# EasyEDA Pro project project.epro, board PCB1
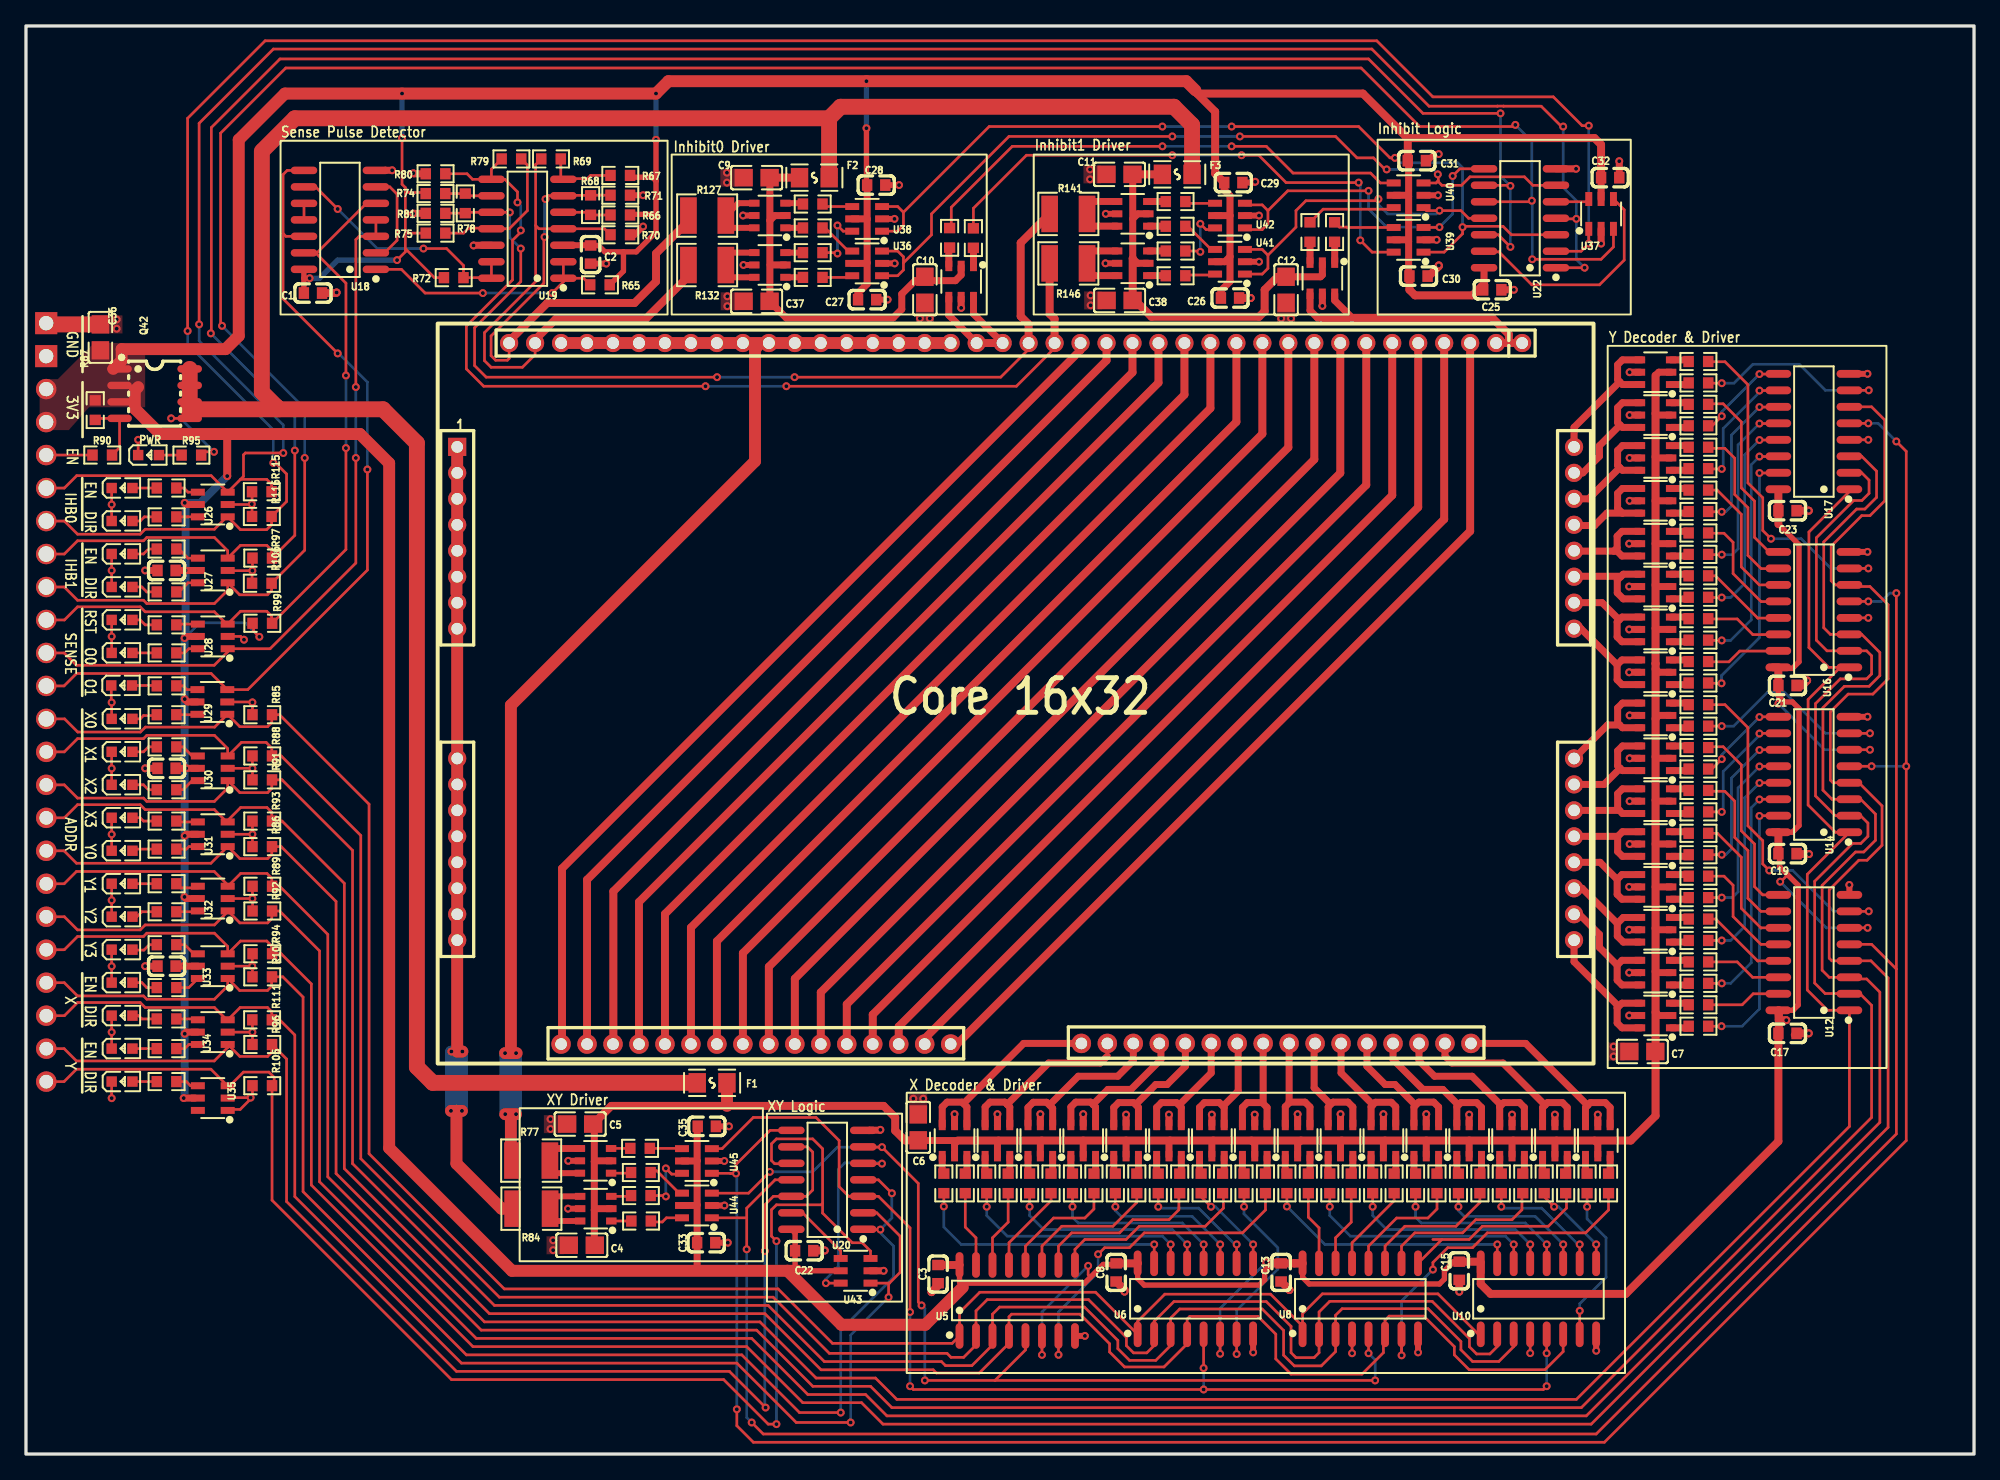
[diagram p4: board, top side]
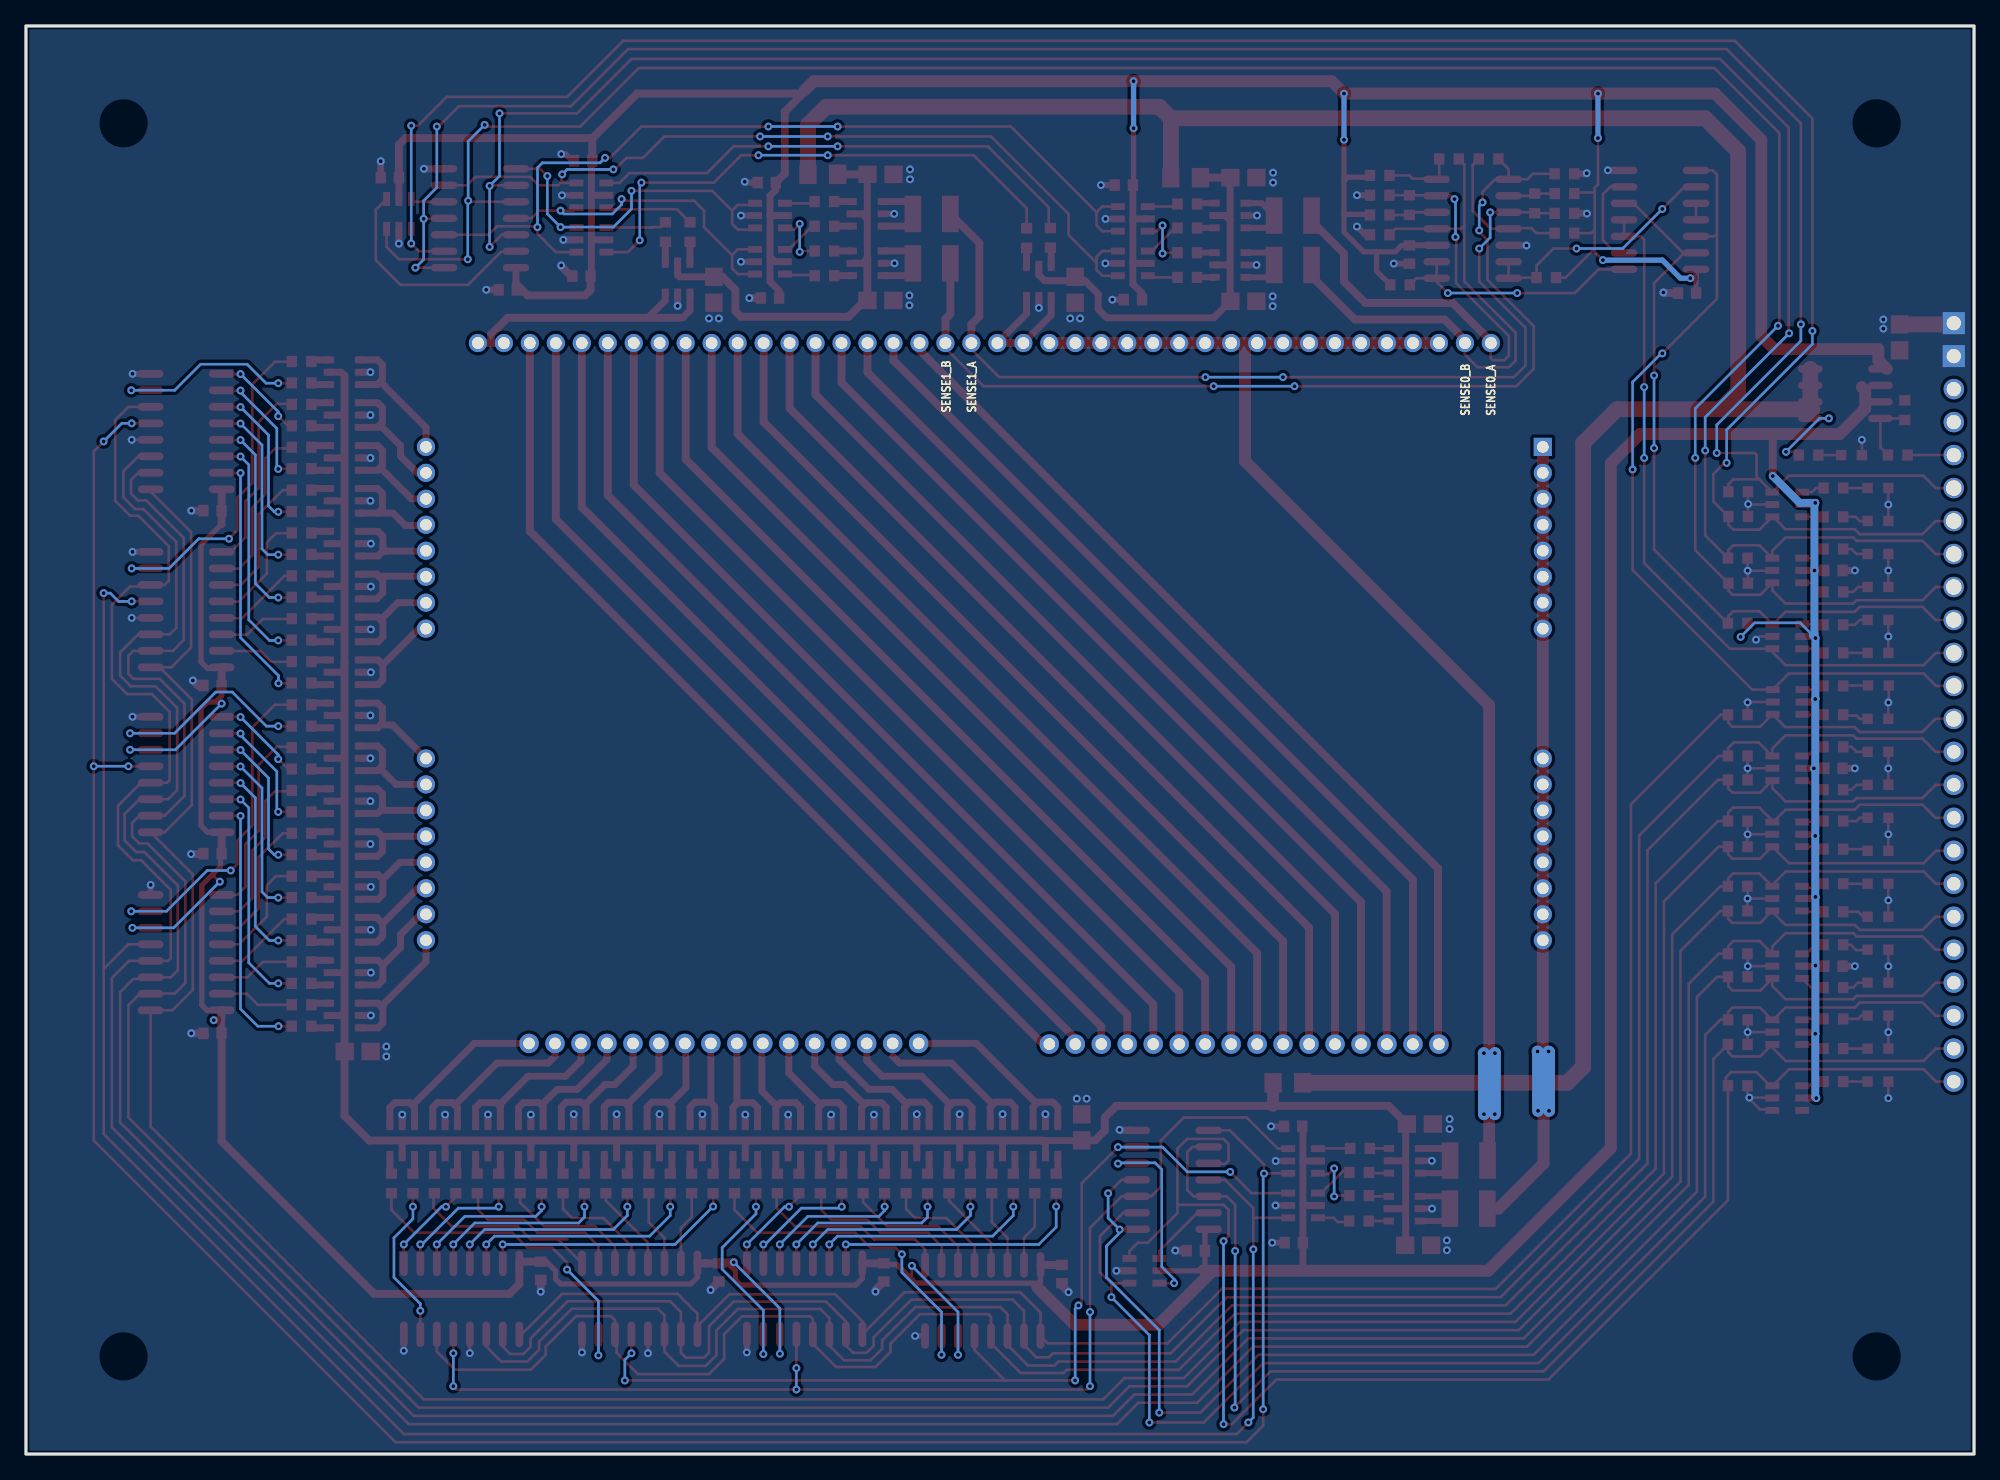
[diagram p5: board, bottom side, seen from below]

Outline 150 x 110 mm; copper layers: Top Layer, Bottom Layer. Coordinates in mm from the lower left corner of the outline.
Outline path: rectangle 0,110 150,0
Stack: Top Layer 0.035mm / Dielectric1 1.51mm FR4 er 4.5 / Bottom Layer 0.035mm

## Design rules (mm)
template: Custom Config
spacing copperThickness1oz (default): track to track 0.102, other pairs 0.152 to 0.3
spacing copperThickness2oz: track to track 0.203, other pairs 0.152 to 0.3
track width copperThickness1oz (default): min 0.127, default 0.203, max 2.54
track width copperThickness2oz: min 0.203, default 0.254, max 2.54
differential pair differentialPair (default): width min 0.127, default 0.254, max 2.54; gap min 0.152, default 0.152
via viaSize (default): diameter min 0.5, default 0.61, max 10; hole min 0.3, default 0.305, max 6.299
net GND uses copperRegion1

## Placement (name value [footprint] x y rotation side)
C1  100nF  [C0603]  22.1 89.43 180 top
C2  100nF  [C0603]  43.48 92.39 270 top
C3  100nF  [C0603]  70.23 13.86 90 top
C4  22uF  [C0805]  42.8 16.08 0 top
C5  22uF  [C0805]  42.67 25.42 0 top
C6  22uF  [C0805]  68.71 25.16 270 top
C7  22uF  [C0805]  124.46 31.01 0 top
C8  100nF  [C0603]  83.95 13.99 90 top
C9  22uF  [C0805]  56.26 98.32 0 top
C10  22uF  [C0805]  69.21 89.68 90 top
C11  22uF  [C0805]  84.2 98.57 0 top
C12  22uF  [C0805]  97.03 89.68 90 top
C13  100nF  [C0603]  96.65 13.99 90 top
C14  100nF  [C0603]  10.83 68.06 180 top
C15  100nF  [C0603]  110.36 14.12 90 top
C16  100nF  [C0603]  10.83 52.82 0 top
C17  100nF  [C0603]  135.64 32.4 180 top
C18  100nF  [C0603]  10.83 37.58 0 top
C19  100nF  [C0603]  135.64 46.25 180 top
C21  100nF  [C0603]  135.64 59.2 180 top
C22  100nF  [C0603]  59.92 15.66 0 top
C23  100nF  [C0603]  135.64 72.66 180 top
C25  100nF  [C0603]  112.91 89.68 0 top
C26  100nF  [C0603]  92.71 89.05 0 top
C27  100nF  [C0603]  64.77 88.92 0 top
C28  100nF  [C0603]  65.47 97.74 0 top
C29  100nF  [C0603]  92.96 97.94 0 top
C30  100nF  [C0603]  107.23 90.73 0 top
C31  100nF  [C0603]  107.1 99.62 0 top
C32  100nF  [C0603]  121.98 98.32 0 top
C33  100nF  [C0603]  52.38 16.28 0 top
C35  100nF  [C0603]  52.42 25.24 0 top
C36  22uF  [C0805]  5.73 86.01 270 top
C37  22uF  [C0805]  56.26 88.79 0 top
C38  22uF  [C0805]  84.21 88.86 0 top
F1  BSMD0805-075-16V  [F0805]  52.83 28.59 0 top
F2  BSMD0805-075-16V  [F0805]  60.71 98.32 180 top
F3  BSMD0805-075-16V  [F0805]  88.65 98.57 180 top
H1  2.0-1*40P母  [HDR-TH_40P-P2.00-V-F]  76.2 85.58 180 top
H2  PM200-1-16-Z-4.3  [HDR-TH_16P-P2.00-V-F]  56.2 31.58 0 top
H3  PM200-1-16-Z-4.3  [HDR-TH_16P-P2.00-V-F]  96.26 31.63 0 top
H4  -  [HDR-TH_5P-P2.54-V-M-NO-SILKSCREEN]  1.56 82.03 270 top
H5  MTP125-1108S1  [HDR-TH_8P-P2.54-H-M-NO-SILKSCREEN]  1.56 65.52 270 top
LED1  GREEN  [LED0603-RD]  9.44 76.94 0 top
LED2  RED  [LED0603-RD]  7.4 74.41 0 top
LED3  RED  [LED0603-RD]  7.4 71.87 0 top
LED4  RED  [LED0603-RD]  7.4 66.79 0 top
LED5  RED  [LED0603-RD]  7.4 69.33 0 top
LED6  RED  [LED0603-RD]  7.4 61.71 0 top
LED7  RED  [LED0603-RD]  7.4 64.25 0 top
LED8  RED  [LED0603-RD]  7.37 59.2 0 top
LED9  RED  [LED0603-RD]  7.4 56.63 0 top
LED10  RED  [LED0603-RD]  7.4 51.55 0 top
LED11  RED  [LED0603-RD]  7.4 54.09 0 top
LED12  RED  [LED0603-RD]  7.4 49.01 0 top
LED13  RED  [LED0603-RD]  7.4 46.47 0 top
LED14  RED  [LED0603-RD]  7.4 43.93 0 top
LED15  RED  [LED0603-RD]  7.4 41.39 0 top
LED16  RED  [LED0603-RD]  7.4 36.31 0 top
LED17  RED  [LED0603-RD]  7.4 38.85 0 top
LED18  RED  [LED0603-RD]  7.4 33.77 0 top
LED19  RED  [LED0603-RD]  7.4 31.23 0 top
LED20  RED  [LED0603-RD]  7.4 28.69 0 top
Q1  DMG6602SVT-7  [TSOT-23-6_L2.9-W1.6-P0.95-LS2.8-BR]  71.5 24.15 270 top
Q2  DMG6602SVT-7  [TSOT-23-6_L2.9-W1.6-P0.95-LS2.8-BR]  74.8 24.15 270 top
Q3  DMG6602SVT-7  [TSOT-23-6_L2.9-W1.6-P0.95-LS2.8-BR]  78.11 24.15 270 top
Q4  DMG6602SVT-7  [TSOT-23-6_L2.9-W1.6-P0.95-LS2.8-BR]  81.41 24.15 270 top
Q5  DMG6602SVT-7  [TSOT-23-6_L2.9-W1.6-P0.95-LS2.8-BR]  84.71 24.15 270 top
Q6  DMG6602SVT-7  [TSOT-23-6_L2.9-W1.6-P0.95-LS2.8-BR]  88.01 24.15 270 top
Q7  DMG6602SVT-7  [TSOT-23-6_L2.9-W1.6-P0.95-LS2.8-BR]  91.31 24.15 270 top
Q8  DMG6602SVT-7  [TSOT-23-6_L2.9-W1.6-P0.95-LS2.8-BR]  94.61 24.15 270 top
Q9  DMG6602SVT-7  [TSOT-23-6_L2.9-W1.6-P0.95-LS2.8-BR]  97.92 24.15 270 top
Q10  DMG6602SVT-7  [TSOT-23-6_L2.9-W1.6-P0.95-LS2.8-BR]  101.22 24.15 270 top
Q11  DMG6602SVT-7  [TSOT-23-6_L2.9-W1.6-P0.95-LS2.8-BR]  104.52 24.15 270 top
Q12  DMG6602SVT-7  [TSOT-23-6_L2.9-W1.6-P0.95-LS2.8-BR]  107.82 24.15 270 top
Q13  DMG6602SVT-7  [TSOT-23-6_L2.9-W1.6-P0.95-LS2.8-BR]  111.13 24.15 270 top
Q14  DMG6602SVT-7  [TSOT-23-6_L2.9-W1.6-P0.95-LS2.8-BR]  114.43 24.15 270 top
Q15  DMG6602SVT-7  [TSOT-23-6_L2.9-W1.6-P0.95-LS2.8-BR]  117.73 24.15 270 top
Q16  DMG6602SVT-7  [TSOT-23-6_L2.9-W1.6-P0.95-LS2.8-BR]  121.03 24.15 270 top
Q17  DMG6602SVT-7  [TSOT-23-6_L2.9-W1.6-P0.95-LS2.8-BR]  125.48 33.78 0 top
Q18  DMG6602SVT-7  [TSOT-23-6_L2.9-W1.6-P0.95-LS2.8-BR]  125.48 37.08 0 top
Q19  DMG6602SVT-7  [TSOT-23-6_L2.9-W1.6-P0.95-LS2.8-BR]  125.48 40.38 0 top
Q20  DMG6602SVT-7  [TSOT-23-6_L2.9-W1.6-P0.95-LS2.8-BR]  125.48 43.69 0 top
Q21  DMG6602SVT-7  [TSOT-23-6_L2.9-W1.6-P0.95-LS2.8-BR]  125.48 46.99 0 top
Q22  DMG6602SVT-7  [TSOT-23-6_L2.9-W1.6-P0.95-LS2.8-BR]  125.48 50.29 0 top
Q23  DMG6602SVT-7  [TSOT-23-6_L2.9-W1.6-P0.95-LS2.8-BR]  125.48 53.59 0 top
Q24  DMG6602SVT-7  [TSOT-23-6_L2.9-W1.6-P0.95-LS2.8-BR]  125.48 56.89 0 top
Q25  DMG6602SVT-7  [TSOT-23-6_L2.9-W1.6-P0.95-LS2.8-BR]  125.48 60.22 0 top
Q26  DMG6602SVT-7  [TSOT-23-6_L2.9-W1.6-P0.95-LS2.8-BR]  125.48 63.52 0 top
Q27  DMG6602SVT-7  [TSOT-23-6_L2.9-W1.6-P0.95-LS2.8-BR]  125.48 66.82 0 top
Q28  DMG6602SVT-7  [TSOT-23-6_L2.9-W1.6-P0.95-LS2.8-BR]  125.48 70.12 0 top
Q29  DMG6602SVT-7  [TSOT-23-6_L2.9-W1.6-P0.95-LS2.8-BR]  125.48 73.42 0 top
Q30  DMG6602SVT-7  [TSOT-23-6_L2.9-W1.6-P0.95-LS2.8-BR]  125.48 76.73 0 top
Q31  DMG6602SVT-7  [TSOT-23-6_L2.9-W1.6-P0.95-LS2.8-BR]  125.48 80.03 0 top
Q32  DMG6602SVT-7  [TSOT-23-6_L2.9-W1.6-P0.95-LS2.8-BR]  125.48 83.33 0 top
Q33  DMG6602SVT-7  [TSOT-23-6_L2.9-W1.6-P0.95-LS2.8-BR]  43.85 22.58 0 top
Q34  DMG6602SVT-7  [TSOT-23-6_L2.9-W1.6-P0.95-LS2.8-BR]  43.87 18.9 0 top
Q36  DMG6602SVT-7  [TSOT-23-6_L2.9-W1.6-P0.95-LS2.8-BR]  57.28 95.4 0 top
Q37  DMG6602SVT-7  [TSOT-23-6_L2.9-W1.6-P0.95-LS2.8-BR]  57.28 91.59 0 top
Q38  DMG6602SVT-7  [TSOT-23-6_L2.9-W1.6-P0.95-LS2.8-BR]  72.01 90.31 90 top
Q39  DMG6602SVT-7  [TSOT-23-6_L2.9-W1.6-P0.95-LS2.8-BR]  85.22 95.53 0 top
Q40  DMG6602SVT-7  [TSOT-23-6_L2.9-W1.6-P0.95-LS2.8-BR]  85.22 91.72 0 top
Q41  DMG6602SVT-7  [TSOT-23-6_L2.9-W1.6-P0.95-LS2.8-BR]  99.82 90.57 90 top
Q42  VBA2311  [SO-8_L4.9-W3.9-P1.27-LS5.9-BL]  9.91 81.68 270 top
R1  150Ω  [R0603]  70.68 20.85 90 top
R2  150Ω  [R0603]  72.33 20.85 90 top
R3  150Ω  [R0603]  73.98 20.85 90 top
R4  150Ω  [R0603]  75.63 20.85 90 top
R5  150Ω  [R0603]  77.28 20.85 90 top
R6  150Ω  [R0603]  78.93 20.85 90 top
R7  150Ω  [R0603]  80.58 20.85 90 top
R8  150Ω  [R0603]  82.23 20.85 90 top
R9  150Ω  [R0603]  83.88 20.85 90 top
R10  150Ω  [R0603]  85.53 20.85 90 top
R11  150Ω  [R0603]  87.19 20.85 90 top
R12  150Ω  [R0603]  88.84 20.85 90 top
R13  150Ω  [R0603]  90.49 20.85 90 top
R14  150Ω  [R0603]  92.14 20.85 90 top
R15  150Ω  [R0603]  93.79 20.85 90 top
R16  150Ω  [R0603]  95.44 20.85 90 top
R17  150Ω  [R0603]  97.09 20.85 90 top
R18  150Ω  [R0603]  98.74 20.85 90 top
R19  150Ω  [R0603]  100.39 20.85 90 top
R20  150Ω  [R0603]  102.04 20.85 90 top
R21  150Ω  [R0603]  103.7 20.85 90 top
R22  150Ω  [R0603]  105.35 20.85 90 top
R23  150Ω  [R0603]  107 20.85 90 top
R24  150Ω  [R0603]  108.65 20.85 90 top
R25  150Ω  [R0603]  110.3 20.85 90 top
R26  150Ω  [R0603]  111.95 20.85 90 top
R27  150Ω  [R0603]  113.6 20.85 90 top
R28  150Ω  [R0603]  115.25 20.85 90 top
R29  150Ω  [R0603]  116.9 20.85 90 top
R30  150Ω  [R0603]  118.55 20.85 90 top
R31  150Ω  [R0603]  120.21 20.85 90 top
R32  150Ω  [R0603]  121.86 20.85 90 top
R33  150Ω  [R0603]  128.78 32.95 180 top
R34  150Ω  [R0603]  128.78 34.6 180 top
R35  150Ω  [R0603]  128.78 36.26 180 top
R36  150Ω  [R0603]  128.78 37.91 180 top
R37  150Ω  [R0603]  128.78 39.56 180 top
R38  150Ω  [R0603]  128.78 41.21 180 top
R39  150Ω  [R0603]  128.78 42.86 180 top
R40  150Ω  [R0603]  128.78 44.51 180 top
R41  150Ω  [R0603]  128.78 46.16 180 top
R42  150Ω  [R0603]  128.78 47.81 180 top
R43  150Ω  [R0603]  128.78 49.46 180 top
R44  150Ω  [R0603]  128.78 51.11 180 top
R45  150Ω  [R0603]  128.78 52.77 180 top
R46  150Ω  [R0603]  128.78 54.42 180 top
R47  150Ω  [R0603]  128.78 56.07 180 top
R48  150Ω  [R0603]  128.78 57.72 180 top
R49  150Ω  [R0603]  128.78 59.39 180 top
R50  150Ω  [R0603]  128.78 61.04 180 top
R51  150Ω  [R0603]  128.78 62.69 180 top
R52  150Ω  [R0603]  128.78 64.34 180 top
R53  150Ω  [R0603]  128.78 65.99 180 top
R54  150Ω  [R0603]  128.78 67.65 180 top
R55  150Ω  [R0603]  128.78 69.3 180 top
R56  150Ω  [R0603]  128.78 70.95 180 top
R57  150Ω  [R0603]  128.78 72.6 180 top
R58  150Ω  [R0603]  128.78 74.25 180 top
R59  150Ω  [R0603]  128.78 75.9 180 top
R60  150Ω  [R0603]  128.78 77.55 180 top
R61  150Ω  [R0603]  128.78 79.2 180 top
R62  150Ω  [R0603]  128.78 80.85 180 top
R63  150Ω  [R0603]  128.78 82.5 180 top
R64  150Ω  [R0603]  128.78 84.16 180 top
R65  1kΩ  [R0603]  44.2 90.06 0 top
R66  1kΩ  [R0603]  45.76 95.44 0 top
R67  1kΩ  [R0603]  45.76 98.49 0 top
R68  24  [R0603]  43.48 96.2 90 top
R69  24  [R0603]  40.43 99.76 0 top
R70  1kΩ  [R0603]  45.76 93.92 180 top
R71  1kΩ  [R0603]  45.76 96.96 180 top
R72  1kΩ  [R0603]  32.94 90.61 180 top
R73  150Ω  [R0603]  47.34 21.69 180 top
R74  1kΩ  [R0603]  31.53 97.09 180 top
R75  1kΩ  [R0603]  31.54 94.04 180 top
R76  150Ω  [R0603]  47.28 23.54 180 top
R77  10Ω  [R1210]  38.9 22.6 0 top
R78  24  [R0603]  33.83 96.34 270 top
R79  24  [R0603]  37.38 99.76 0 top
R80  1kΩ  [R0603]  31.54 98.61 0 top
R81  1kΩ  [R0603]  31.54 95.57 0 top
R82  150Ω  [R0603]  47.36 17.95 180 top
R83  150Ω  [R0603]  47.34 19.91 180 top
R84  10Ω  [R1210]  38.92 18.9 0 top
R85  10kΩ  [R0603]  18.19 56.95 0 top
R86  10kΩ  [R0603]  18.19 46.79 180 top
R87  10kΩ  [R0603]  5.33 80.41 270 top
R88  10kΩ  [R0603]  18.19 53.77 0 top
R89  10kΩ  [R0603]  18.2 43.73 0 top
R90  1kΩ  [R0603]  5.87 76.95 180 top
R91  10kΩ  [R0603]  18.19 51.93 0 top
R92  10kΩ  [R0603]  18.2 41.83 180 top
R93  10kΩ  [R0603]  18.19 48.75 0 top
R94  10kΩ  [R0603]  18.2 38.54 180 top
R95  5.1kΩ  [R0603]  12.74 76.94 180 top
R96  10kΩ  [R0603]  18.19 31.55 0 top
R97  10kΩ  [R0603]  18.19 69.01 180 top
R98  2.7kΩ  [R0603]  10.83 74.41 0 top
R99  10kΩ  [R0603]  18.2 63.99 180 top
R100  2.7kΩ  [R0603]  10.83 66.41 180 top
R101  2.7kΩ  [R0603]  10.83 72.19 0 top
R102  2.7kΩ  [R0603]  10.83 69.71 0 top
R103  2.7kΩ  [R0603]  10.83 61.71 180 top
R104  2.7kΩ  [R0603]  10.83 63.87 180 top
R105  10kΩ  [R0603]  18.19 28.37 180 top
R106  10kΩ  [R0603]  18.16 67.07 180 top
R107  10kΩ  [R0603]  18.19 36.76 180 top
R108  2.7kΩ  [R0603]  10.83 59.17 0 top
R109  2.7kΩ  [R0603]  10.83 51.17 0 top
R110  2.7kΩ  [R0603]  10.83 56.95 0 top
R111  10kΩ  [R0603]  18.18 33.45 180 top
R112  2.7kΩ  [R0603]  10.83 54.47 0 top
R113  2.7kΩ  [R0603]  10.83 48.75 0 top
R114  2.7kΩ  [R0603]  10.83 46.6 0 top
R115  10kΩ  [R0603]  18.16 74.12 0 top
R116  10kΩ  [R0603]  18.16 72.22 180 top
R117  2.7kΩ  [R0603]  10.83 43.93 0 top
R118  2.7kΩ  [R0603]  10.83 35.93 180 top
R119  2.7kΩ  [R0603]  10.83 41.77 0 top
R120  2.7kΩ  [R0603]  10.83 39.23 0 top
R121  2.7kΩ  [R0603]  10.83 33.52 180 top
R122  2.7kΩ  [R0603]  10.83 31.23 180 top
R123  2.7kΩ  [R0603]  10.83 28.69 0 top
R125  150Ω  [R0603]  60.58 94.44 180 top
R126  150Ω  [R0603]  60.58 96.28 180 top
R127  10Ω  [R1210]  52.45 95.39 0 top
R130  150Ω  [R0603]  60.58 90.63 180 top
R131  150Ω  [R0603]  60.58 92.54 180 top
R132  10Ω  [R1210]  52.45 91.58 0 top
R135  150Ω  [R0603]  72.95 93.66 270 top
R136  150Ω  [R0603]  71.12 93.68 270 top
R139  150Ω  [R0603]  88.52 94.57 180 top
R140  150Ω  [R0603]  88.52 96.47 180 top
R141  10Ω  [R1210]  80.26 95.52 0 top
R144  150Ω  [R0603]  88.52 90.76 180 top
R145  150Ω  [R0603]  88.52 92.66 180 top
R146  10Ω  [R1210]  80.26 91.71 0 top
R149  150Ω  [R0603]  100.76 94.12 270 top
R150  150Ω  [R0603]  98.87 94.12 270 top
U1  PM200-1-08-Z-4.3  [HDR-TH_8P-P2.00-V-F#2]  33.2 70.58 270 top
U2  PM200-1-08-Z-4.3  [HDR-TH_8P-P2.00-V-F]  119.2 70.58 90 top
U3  PM200-1-08-Z-4.3  [HDR-TH_8P-P2.00-V-F]  33.2 46.58 270 top
U4  PM200-1-08-Z-4.3  [HDR-TH_8P-P2.00-V-F]  119.2 46.58 90 top
U5  74HC138D,653  [SOIC-16_L9.9-W3.9-P1.27-LS6.0-BL]  76.33 11.83 0 top
U6  74HC238D,653  [SOIC-16_L9.9-W3.9-P1.27-LS6.0-BL]  90.04 11.96 0 top
U7  MTP125-1111S1  [HDR-TH_11P-P2.54-V-M]  1.56 41.38 270 top
U8  74HC138D,653  [SOIC-16_L9.9-W3.9-P1.27-LS6.0-BL]  102.74 11.96 0 top
U10  74HC238D,653  [SOIC-16_L9.9-W3.9-P1.27-LS6.0-BL]  116.46 11.96 0 top
U12  74HC138D,653  [SOIC-16_L9.9-W3.9-P1.27-LS6.0-BL]  137.67 38.63 90 top
U14  74HC238D,653  [SOIC-16_L9.9-W3.9-P1.27-LS6.0-BL]  137.67 52.34 90 top
U16  74HC138D,653  [SOIC-16_L9.9-W3.9-P1.27-LS6.0-BL]  137.67 65.04 90 top
U17  74HC238D,653  [SOIC-16_L9.9-W3.9-P1.27-LS6.0-BL]  137.67 78.76 90 top
U18  74HC00D,653  [SOIC-14_L8.7-W3.9-P1.27-LS6.0-BL]  24.18 95.06 90 top
U19  LM339LVDR  [SOIC-14_L8.7-W3.9-P1.27-LS6.0-BL]  38.61 94.38 90 top
U20  74HC00D,653  [SOIC-14_L8.7-W3.9-P1.27-LS6.0-BL]  61.7 21.12 90 top
U22  74HC00D,653  [SOIC-14_L8.7-W3.9-P1.27-LS6.0-BL]  115.04 95.19 90 top
U26  SN74LVC2G17DBVR  [SOT-23-6_L2.9-W1.6-P0.95-LS2.8-BL]  14.38 73.14 90 top
U27  SN74LVC2G17DBVR  [SOT-23-6_L2.9-W1.6-P0.95-LS2.8-BL]  14.38 68.06 90 top
U28  SN74LVC2G17DBVR  [SOT-23-6_L2.9-W1.6-P0.95-LS2.8-BL]  14.38 62.98 90 top
U29  SN74LVC2G17DBVR  [SOT-23-6_L2.9-W1.6-P0.95-LS2.8-BL]  14.35 57.93 90 top
U30  SN74LVC2G17DBVR  [SOT-23-6_L2.9-W1.6-P0.95-LS2.8-BL]  14.38 52.82 90 top
U31  SN74LVC2G17DBVR  [SOT-23-6_L2.9-W1.6-P0.95-LS2.8-BL]  14.38 47.74 90 top
U32  SN74LVC2G17DBVR  [SOT-23-6_L2.9-W1.6-P0.95-LS2.8-BL]  14.38 42.79 90 top
U33  SN74LVC2G17DBVR  [SOT-23-6_L2.9-W1.6-P0.95-LS2.8-BL]  14.38 37.58 90 top
U34  SN74LVC2G17DBVR  [SOT-23-6_L2.9-W1.6-P0.95-LS2.8-BL]  14.38 32.5 90 top
U35  SN74LVC2G17DBVR  [SOT-23-6_L2.9-W1.6-P0.95-LS2.8-BL]  14.38 27.42 90 top
U36  SN74LVC2G14DBVR  [SOT-23-6_L2.9-W1.6-P0.95-LS2.8-BL]  64.77 91.71 90 top
U37  SN74LVC2G14DBVR  [SOT-23-6_L2.9-W1.6-P0.95-LS2.8-BL]  121.29 95.52 0 top
U38  SN74LVC2G17DBVR  [SOT-23-6_L2.9-W1.6-P0.95-LS2.8-BL]  64.77 95.14 90 top
U39  SN74LVC2G14DBVR  [SOT-23-6_L2.9-W1.6-P0.95-LS2.8-BL]  106.46 93.53 90 top
U40  SN74LVC2G17DBVR  [SOT-23-6_L2.9-W1.6-P0.95-LS2.8-BL]  106.46 96.96 90 top
U41  SN74LVC2G14DBVR  [SOT-23-6_L2.9-W1.6-P0.95-LS2.8-BL]  92.71 91.84 90 top
U42  SN74LVC2G17DBVR  [SOT-23-6_L2.9-W1.6-P0.95-LS2.8-BL]  92.71 95.39 90 top
U43  SN74LVC2G14DBVR  [SOT-23-6_L2.9-W1.6-P0.95-LS2.8-BL]  63.88 14.12 90 top
U44  SN74LVC2G14DBVR  [SOT-23-6_L2.9-W1.6-P0.95-LS2.8-BL]  51.66 19.15 90 top
U45  SN74LVC2G17DBVR  [SOT-23-6_L2.9-W1.6-P0.95-LS2.8-BL]  51.66 22.57 90 top

## Footprints (pads in the part's own frame, mm; a bottom-side part is the same pattern mirrored in y, then rotated)
C0603
  rect 0.8x0.9 smd: 1(-0.7,0) 2(0.7,0)
C0805
  rect 1.41x1.35 smd: 1(-1,0) 2(1,0)
F0805
  rect 1.335x1.5 smd: 1(-1.143,0) 2(1.143,0)
HDR-TH_5P-P2.54-V-M-NO-SILKSCREEN
  rect 1.7x1.7 hole 1.1: 1(-5.08,0) 2(-2.54,0)
  round 1.575 hole 1.1x0.889: 3(0,0) 4(2.54,0) 5(5.08,0)
HDR-TH_8P-P2.00-V-F
  round 1.4 hole 0.899: 1(-7,0) 2(-5,0) 3(-3,0) 4(-1,0) 5(1,0) 6(3,0) 7(5,0) 8(7,0)
HDR-TH_8P-P2.00-V-F#2
  rect 1.4x1.4 hole 0.899: 1(-7,0)
  round 1.4 hole 0.899: 2(-5,0) 3(-3,0) 4(-1,0) 5(1,0) 6(3,0) 7(5,0) 8(7,0)
HDR-TH_8P-P2.54-H-M-NO-SILKSCREEN
  round 1.575 hole 1.2x0.889: 1(-8.89,0) 2(-6.35,0) 3(-3.81,0) 4(-1.27,0) 5(1.27,0) 6(3.81,0) 7(6.35,0) 8(8.89,0)
HDR-TH_11P-P2.54-V-M
  round 1.575 hole 1.05x0.889: 1(-12.7,0) 2(-10.16,0) 3(-7.62,0) 4(-5.08,0) 5(-2.54,0) 6(0,0) 7(2.54,0) 8(5.08,0) 9(7.62,0) 10(10.16,0) 11(12.7,0)
HDR-TH_16P-P2.00-V-F
  round 1.5 hole 0.9: 1(-15,0) 2(-13,0) 3(-11,0) 4(-9,0) 5(-7,0) 6(-5,0) 7(-3,0) 8(-1,0) 9(1,0) 10(3,0) 11(5,0) 12(7,0) 13(9,0) 14(11,0) 15(13,0) 16(15,0)
HDR-TH_40P-P2.00-V-F
  round 1.399 hole 0.914x0.899: 1(-39,0) 2(-37,0) 3(-35,0) 4(-33,0) 5(-31,0) 6(-29,0) 7(-27,0) 8(-25,0) 9(-23,0) 10(-21,0) 11(-19,0) 12(-17,0) 13(-15,0) 14(-13,0) 15(-11,0) 16(-9,0) 17(-7,0) 18(-5,0) 19(-3,0) 20(-1,0) 21(1,0) 22(3,0) 23(5,0) 24(7,0) 25(9,0) 26(11,0) 27(13,0) 28(15,0) 29(17,0) 30(19,0) 31(21,0) 32(23,0) 33(25,0) 34(27,0) 35(29,0) 36(31,0) 37(33,0) 38(35,0) 39(37,0) 40(39,0)
LED0603-RD
  rect 0.8x0.8 smd: 1(-0.799,0) 2(0.799,0)
R0603
  rect 0.806x0.864 smd: 1(-0.753,0) 2(0.753,0)
R1210
  rect 1.282x2.808 smd: 1(-1.441,0) 2(1.441,0)
SO-8_L4.9-W3.9-P1.27-LS5.9-BL
  oval 0.574x1.888 smd: 1(-1.905,-2.699) 2(-0.635,-2.699) 3(0.635,-2.699) 4(1.905,-2.699) 5(1.905,2.699) 6(0.635,2.699) 7(-0.635,2.699) 8(-1.905,2.699)
SOIC-14_L8.7-W3.9-P1.27-LS6.0-BL
  oval 0.574x2.038 smd: 1(-3.81,-2.769) 2(-2.54,-2.769) 3(-1.27,-2.769) 4(0,-2.769) 5(1.27,-2.769) 6(2.54,-2.769) 7(3.81,-2.769) 8(3.81,2.769) 9(2.54,2.769) 10(1.27,2.769) 11(0,2.769) 12(-1.27,2.769) 13(-2.54,2.769) 14(-3.81,2.769)
SOIC-16_L9.9-W3.9-P1.27-LS6.0-BL
  oval 0.602x1.971 smd: 1(-4.445,-2.736) 2(-3.175,-2.736) 3(-1.905,-2.736) 4(-0.635,-2.736) 5(0.635,-2.736) 6(1.905,-2.736) 7(3.175,-2.736) 8(4.445,-2.736) 9(4.445,2.736) 10(3.175,2.736) 11(1.905,2.736) 12(0.635,2.736) 13(-0.635,2.736) 14(-1.905,2.736) 15(-3.175,2.736) 16(-4.445,2.736)
SOT-23-6_L2.9-W1.6-P0.95-LS2.8-BL
  rect 0.532x1.072 smd: 1(-0.95,-1.149) 2(0,-1.149) 3(0.95,-1.149) 4(0.95,1.149) 5(0,1.149) 6(-0.95,1.149)
TSOT-23-6_L2.9-W1.6-P0.95-LS2.8-BR
  rect 0.8x0.532 smd: 1(1.2,-0.95) 2(1.2,0) 3(1.2,0.95) 4(-1.2,0.95) 5(-1.2,0) 6(-1.2,-0.95)

## Nets
3V3: C1.2 C2.1 C3.2 C8.2 C13.2 C14.1 C15.2 C16.2 C17.2 C18.2 C19.2 C21.2 C22.1 C23.2 C25.1 C26.1 C27.1 C28.1 C29.1 C30.1 C31.1 C32.1 C33.1 C35.1 C36.2 H4.3 H4.4 Q42.1 Q42.2 Q42.3 R65.2 R66.2 R67.2 R72.2 R74.2 R75.2 R87.1 R99.2 U5.6 U5.16 U6.6 U6.16 U8.16 U10.16 U12.6 U12.16 U14.6 U14.16 U16.16 U17.16 U18.14 U19.3 U20.14 U22.14 U26.5 U27.5 U28.5 U29.5 U30.5 U31.5 U32.5 U33.5 U34.5 U35.5 U36.5 U37.5 U38.5 U39.5 U40.5 U41.5 U42.5 U43.5 U44.5 U45.5
3V3_GATED: F1.1 F2.1 F3.1 Q42.5 Q42.6 Q42.7 Q42.8 R95.1
3V3_IHB0: C9.2 C10.2 C37.2 F2.2 Q36.2 Q37.2 Q38.2
3V3_IHB1: C11.2 C12.2 C38.2 F3.2 Q39.2 Q40.2 Q41.2
3V3_XY: C4.2 C5.2 C6.2 C7.2 F1.2 Q1.2 Q2.2 Q3.2 Q4.2 Q5.2 Q6.2 Q7.2 Q8.2 Q9.2 Q10.2 Q11.2 Q12.2 Q13.2 Q14.2 Q15.2 Q16.2 Q17.2 Q18.2 Q19.2 Q20.2 Q21.2 Q22.2 Q23.2 Q24.2 Q25.2 Q26.2 Q27.2 Q28.2 Q29.2 Q30.2 Q31.2 Q32.2 Q33.2 Q34.2
GND: C1.1 C2.2 C3.1 C4.1 C5.1 C6.1 C7.1 C8.1 C9.1 C10.1 C11.1 C12.1 C13.1 C14.2 C15.1 C16.1 C17.1 C18.1 C19.1 C21.1 C22.2 C23.1 C25.2 C26.2 C27.2 C28.2 C29.2 C30.2 C31.2 C32.2 C33.2 C35.2 C36.1 C37.1 C38.1 H4.1 H4.2 LED1.1 LED2.1 LED3.1 LED4.1 LED5.1 LED6.1 LED7.1 LED8.1 LED9.1 LED10.1 LED11.1 LED12.1 LED13.1 LED14.1 LED15.1 LED16.1 LED17.1 LED18.1 LED19.1 LED20.1 Q1.5 Q2.5 Q3.5 Q4.5 Q5.5 Q6.5 Q7.5 Q8.5 Q9.5 Q10.5 Q11.5 Q12.5 Q13.5 Q14.5 Q15.5 Q16.5 Q17.5 Q18.5 Q19.5 Q20.5 Q21.5 Q22.5 Q23.5 Q24.5 Q25.5 Q26.5 Q27.5 Q28.5 Q29.5 Q30.5 Q31.5 Q32.5 Q33.5 Q34.5 Q36.5 Q37.5 Q38.5 Q39.5 Q40.5 Q41.5 R70.1 R71.1 R80.1 R81.1 R85.1 R86.2 R88.1 R89.1 R91.1 R92.2 R93.1 R94.2 R96.1 R97.2 R105.2 R106.2 R107.2 R111.2 R115.1 R116.2 U5.8 U6.8 U8.4 U8.8 U10.4 U10.8 U12.8 U14.8 U16.4 U16.8 U17.4 U17.8 U18.7 U19.12 U20.7 U22.7 U26.2 U27.2 U28.2 U29.2 U30.2 U31.2 U32.2 U33.2 U34.2 U35.1 U35.2 U36.2 U37.2 U38.2 U39.2 U40.2 U41.2 U42.2 U43.2 U44.2 U45.2
$1I231724\$1N959: Q1.1 R1.2
$1I231724\$1N972: Q2.1 R3.2
$1I231724\$1N982: Q2.3 R4.2
$1I231724\$1N1257: Q4.1 R7.2
$1I231724\$1N1261: Q3.3 R6.2
$1I231724\$1N1273: Q3.1 R5.2
$1I231724\$1N2409: Q1.3 R2.2
$1I231724\$1N2651: Q4.3 R8.2
$1I231724\$1N7281: Q6.1 R11.2
$1I231724\$1N7282: Q6.3 R12.2
$1I231724\$1N7283: Q7.1 R13.2
$1I231724\$1N7284: Q7.3 R14.2
$1I231724\$1N7285: Q8.1 R15.2
$1I231724\$1N7286: Q8.3 R16.2
$1I231724\$1N7287: Q5.1 R9.2
$1I231724\$1N7288: Q5.3 R10.2
$1I237831\$1N959: Q9.1 R17.2
$1I237831\$1N972: Q10.1 R19.2
$1I237831\$1N982: Q10.3 R20.2
$1I237831\$1N1257: Q12.1 R23.2
$1I237831\$1N1261: Q11.3 R22.2
$1I237831\$1N1273: Q11.1 R21.2
$1I237831\$1N2409: Q9.3 R18.2
$1I237831\$1N2651: Q12.3 R24.2
$1I237831\$1N7281: Q14.1 R27.2
$1I237831\$1N7282: Q14.3 R28.2
$1I237831\$1N7283: Q15.1 R29.2
$1I237831\$1N7284: Q15.3 R30.2
$1I237831\$1N7285: Q16.1 R31.2
$1I237831\$1N7286: Q16.3 R32.2
$1I237831\$1N7287: Q13.1 R25.2
$1I237831\$1N7288: Q13.3 R26.2
$1I237941\$1N959: Q17.1 R33.2
$1I237941\$1N972: Q18.1 R35.2
$1I237941\$1N982: Q18.3 R36.2
$1I237941\$1N1257: Q20.1 R39.2
$1I237941\$1N1261: Q19.3 R38.2
$1I237941\$1N1273: Q19.1 R37.2
$1I237941\$1N2409: Q17.3 R34.2
$1I237941\$1N2651: Q20.3 R40.2
$1I237941\$1N7281: Q22.1 R43.2
$1I237941\$1N7282: Q22.3 R44.2
$1I237941\$1N7283: Q23.1 R45.2
$1I237941\$1N7284: Q23.3 R46.2
$1I237941\$1N7285: Q24.1 R47.2
$1I237941\$1N7286: Q24.3 R48.2
$1I237941\$1N7287: Q21.1 R41.2
$1I237941\$1N7288: Q21.3 R42.2
$1I238051\$1N959: Q25.1 R49.2
$1I238051\$1N972: Q26.1 R51.2
$1I238051\$1N982: Q26.3 R52.2
$1I238051\$1N1257: Q28.1 R55.2
$1I238051\$1N1261: Q27.3 R54.2
$1I238051\$1N1273: Q27.1 R53.2
$1I238051\$1N2409: Q25.3 R50.2
$1I238051\$1N2651: Q28.3 R56.2
$1I238051\$1N7281: Q30.1 R59.2
$1I238051\$1N7282: Q30.3 R60.2
$1I238051\$1N7283: Q31.1 R61.2
$1I238051\$1N7284: Q31.3 R62.2
$1I238051\$1N7285: Q32.1 R63.2
$1I238051\$1N7286: Q32.3 R64.2
$1I238051\$1N7287: Q29.1 R57.2
$1I238051\$1N7288: Q29.3 R58.2
DRV_X0_N: R1.1 U6.15
DRV_X0_P: R2.1 U5.15
DRV_X1_N: R3.1 U6.14
DRV_X1_P: R4.1 U5.14
DRV_X2_N: R5.1 U6.13
DRV_X2_P: R6.1 U5.13
DRV_X3_N: R7.1 U6.12
DRV_X3_P: R8.1 U5.12
DRV_X4_N: R9.1 U6.11
DRV_X4_P: R10.1 U5.11
DRV_X5_N: R11.1 U6.10
DRV_X5_P: R12.1 U5.10
DRV_X6_N: R13.1 U6.9
DRV_X6_P: R14.1 U5.9
DRV_X7_N: R15.1 U6.7
DRV_X7_P: R16.1 U5.7
DRV_X8_N: R17.1 U10.15
DRV_X8_P: R18.1 U8.15
DRV_X9_N: R19.1 U10.14
DRV_X9_P: R20.1 U8.14
DRV_X10_N: R21.1 U10.13
DRV_X10_P: R22.1 U8.13
DRV_X11_N: R23.1 U10.12
DRV_X11_P: R24.1 U8.12
DRV_X12_N: R25.1 U10.11
DRV_X12_P: R26.1 U8.11
DRV_X13_N: R27.1 U10.10
DRV_X13_P: R28.1 U8.10
DRV_X14_N: R29.1 U10.9
DRV_X14_P: R30.1 U8.9
DRV_X15_N: R31.1 U10.7
DRV_X15_P: R32.1 U8.7
DRV_X_138: U5.5 U8.5 U20.6 U44.3
DRV_X_238: U6.5 U10.5 U20.3 U45.3
DRV_Y0_N: R33.1 U14.15
DRV_Y0_P: R34.1 U12.15
DRV_Y1_N: R35.1 U14.14
DRV_Y1_P: R36.1 U12.14
DRV_Y2_N: R37.1 U14.13
DRV_Y2_P: R38.1 U12.13
DRV_Y3_N: R39.1 U14.12
DRV_Y3_P: R40.1 U12.12
DRV_Y4_N: R41.1 U14.11
DRV_Y4_P: R42.1 U12.11
DRV_Y5_N: R43.1 U14.10
DRV_Y5_P: R44.1 U12.10
DRV_Y6_N: R45.1 U14.9
DRV_Y6_P: R46.1 U12.9
DRV_Y7_N: R47.1 U14.7
DRV_Y7_P: R48.1 U12.7
DRV_Y8_N: R49.1 U17.15
DRV_Y8_P: R50.1 U16.15
DRV_Y9_N: R51.1 U17.14
DRV_Y9_P: R52.1 U16.14
DRV_Y10_N: R53.1 U17.13
DRV_Y10_P: R54.1 U16.13
DRV_Y11_N: R55.1 U17.12
DRV_Y11_P: R56.1 U16.12
DRV_Y12_N: R57.1 U17.11
DRV_Y12_P: R58.1 U16.11
DRV_Y13_N: R59.1 U17.10
DRV_Y13_P: R60.1 U16.10
DRV_Y14_N: R61.1 U17.9
DRV_Y14_P: R62.1 U16.9
DRV_Y15_N: R63.1 U17.7
DRV_Y15_P: R64.1 U16.7
DRV_Y_138: U12.5 U16.5 U20.11 U44.1
DRV_Y_238: U14.5 U17.5 U20.8 U45.1
IN_ADDR_X0: H5.8 R85.2 U5.1 U6.1 U8.1 U10.1 U29.1
IN_ADDR_X1: R88.2 U5.2 U6.2 U7.1 U8.2 U10.2 U30.3
IN_ADDR_X2: R91.2 U5.3 U6.3 U7.2 U8.3 U10.3 U30.1
IN_ADDR_X3: R93.2 U5.4 U6.4 U7.3 U8.6 U10.6 U31.3
IN_ADDR_Y0: R86.1 U7.4 U12.1 U14.1 U16.1 U17.1 U31.1
IN_ADDR_Y1: R89.2 U7.5 U12.2 U14.2 U16.2 U17.2 U32.3
IN_ADDR_Y2: R92.1 U7.6 U12.3 U14.3 U16.3 U17.3 U32.1
IN_ADDR_Y3: R94.1 U7.7 U12.4 U14.4 U16.6 U17.6 U33.3
IN_DRV_IHB0_DIR: H5.2 R116.1 U22.2 U26.1 U37.1
IN_DRV_IHB0_EN: H5.1 R115.2 U22.1 U22.4 U26.3
IN_DRV_IHB1_DIR: H5.4 R106.1 U22.10 U27.1 U37.3
IN_DRV_IHB1_EN: H5.3 R97.1 U22.9 U22.12 U27.3
IN_DRV_X_DIR: R111.1 U7.9 U20.2 U34.3 U43.1
IN_DRV_X_EN: R107.1 U7.8 U20.1 U20.4 U33.1
IN_DRV_Y_DIR: R105.1 U7.11 U20.10 U35.3 U43.3
IN_DRV_Y_EN: R96.2 U7.10 U20.9 U20.12 U34.1
IN_SENSE_RST: H5.5 R99.1 U18.5 U18.13 U28.3
JP_BUS0: H1.18 H2.1
JP_BUS1: H1.17 H2.2
JP_BUS2: H1.16 H2.3
JP_BUS3: H1.15 H2.4
JP_BUS4: H1.14 H2.5
JP_BUS5: H1.13 H2.6
JP_BUS6: H1.12 H2.7
JP_BUS7: H1.11 H2.8
JP_BUS8: H1.10 H2.9
JP_BUS9: H1.9 H2.10
JP_BUS10: H1.8 H2.11
JP_BUS11: H1.7 H2.12
JP_BUS12: H1.6 H2.13
JP_BUS13: H1.5 H2.14
JP_BUS14: H1.4 H2.15
JP_BUS15: H1.3 H2.16
OUT_SENSE0: H5.6 U18.3 U18.4 U28.1
OUT_SENSE1: H5.7 U18.8 U18.12 U29.3
SENSE0_A: H1.40 R68.2 R71.2 R127.1 U19.6
SENSE0_B: H1.39 R69.1 R70.2 R132.1 U19.4
SENSE0_CENTER: H1.21 H1.22 Q38.4 Q38.6
SENSE1_A: H1.20 R78.2 R81.2 R141.1 U19.10
SENSE1_B: H1.19 R79.1 R80.2 R146.1 U19.8
SENSE1_CENTER: H1.1 H1.2 Q41.4 Q41.6
XCOM: H1.23 H1.24 H1.25 H1.26 H1.27 H1.28 H1.29 H1.30 H1.31 H1.32 H1.33 H1.34 H1.35 H1.36 H1.37 H1.38 R77.1
YCOM: R84.1 U1.1 U1.2 U1.3 U1.4 U1.5 U1.6 U1.7 U1.8 U3.1 U3.2 U3.3 U3.4 U3.5 U3.6 U3.7 U3.8
$1N6793: LED5.2 R102.1
$1N8285: LED4.2 R100.2
$1N8290: LED6.2 R103.2
$1N10722: LED9.2 R110.1
$1N10724: LED11.2 R112.1
$1N10726: LED8.2 R108.1
$1N12499: LED14.2 R117.1
$1N34208: Q42.4 R87.2 R90.1
$1N78042: H3.1 Q1.4 Q1.6
$1N78047: H3.2 Q2.4 Q2.6
$1N78052: H3.3 Q3.4 Q3.6
$1N78058: H3.4 Q4.4 Q4.6
$1N78064: H3.5 Q5.4 Q5.6
$1N78069: H3.6 Q6.4 Q6.6
$1N78075: H3.7 Q7.4 Q7.6
$1N78081: H3.8 Q8.4 Q8.6
$1N85592: Q34.4 Q34.6 R84.2
$1N85600: Q33.4 Q33.6 R77.2
$1N85641: Q33.1 R73.2
$1N85682: Q33.3 R76.2
$1N85721: Q34.1 R82.2
$1N85760: Q34.3 R83.2
$1N86284: Q36.3 R126.2
$1N86286: Q37.1 R130.2
$1N86288: Q37.3 R131.2
$1N86323: Q36.4 Q36.6 R127.2
$1N87818: R73.1 U44.4
$1N87831: R76.1 U45.4
$1N87845: R82.1 U44.6
$1N87858: R83.1 U45.6
$1N88218: H4.5 R90.2
$1N92958: U22.3 U38.1 U38.3 U39.1
$1N116288: Q36.1 R125.2
$1N116317: Q37.4 Q37.6 R132.2
$1N117069: Q38.3 R136.2
$1N117074: Q38.1 R135.2
$1N117219: U22.5 U37.6
$1N158633: R135.1 U39.6
$1N159837: Q41.1 R149.2
$1N159840: Q41.3 R150.2
$1N159842: Q40.3 R145.2
$1N159848: Q40.1 R144.2
$1N159849: Q39.3 R140.2
$1N159852: Q39.4 Q39.6 R141.2
$1N159853: Q40.4 Q40.6 R146.2
$1N159855: Q39.1 R139.2
$1N159864: U22.13 U37.4
$1N159876: R149.1 U39.4
$1N161280: U20.13 U43.4
$1N162043: U18.2 U18.6
$1N162202: U18.10 U18.11
$1N162312: R65.1 U18.1 U19.1 U19.2
$1N162440: R66.1 R68.1 U19.5
$1N162442: R67.1 R69.2 U19.7
$1N162725: R72.1 U18.9 U19.13 U19.14
$1N163428: R75.1 R79.2 U19.11
$1N163467: R74.1 R78.1 U19.9
$1N213750: H3.9 Q9.4 Q9.6
$1N213800: H3.10 Q10.4 Q10.6
$1N213805: H3.11 Q11.4 Q11.6
$1N213811: H3.12 Q12.4 Q12.6
$1N213817: H3.13 Q13.4 Q13.6
$1N213823: H3.14 Q14.4 Q14.6
$1N213829: H3.15 Q15.4 Q15.6
$1N213835: H3.16 Q16.4 Q16.6
$1N238225: Q17.4 Q17.6 U4.1
$1N238235: Q18.4 Q18.6 U4.2
$1N238246: Q19.4 Q19.6 U4.3
$1N238253: Q20.4 Q20.6 U4.4
$1N238263: Q21.4 Q21.6 U4.5
$1N238275: Q22.4 Q22.6 U4.6
$1N238284: Q23.4 Q23.6 U4.7
$1N238291: Q24.4 Q24.6 U4.8
$1N238298: Q25.4 Q25.6 U2.1
$1N238304: Q26.4 Q26.6 U2.2
$1N238314: Q27.4 Q27.6 U2.3
$1N238323: Q28.4 Q28.6 U2.4
$1N238332: Q29.4 Q29.6 U2.5
$1N238338: Q30.4 Q30.6 U2.6
$1N238345: Q31.4 Q31.6 U2.7
$1N238354: Q32.4 Q32.6 U2.8
$1N270627: R98.2 U26.4
$1N270629: R101.2 U26.6
$1N270631: LED2.2 R98.1
$1N270633: LED3.2 R101.1
$1N270816: R102.2 U27.4
$1N271153: R104.1 U28.4
$1N271177: R100.1 U27.6
$1N271179: LED7.2 R104.2
$1N271181: R103.1 U28.6
$1N272502: R110.2 U29.6
$1N272510: R112.2 U30.4
$1N272519: R108.2 U29.4
$1N272528: R109.2 U30.6
$1N272535: R114.2 U31.6
$1N272601: LED10.2 R109.1
$1N272603: LED12.2 R113.1
$1N272605: LED13.2 R114.1
$1N273596: R119.2 U32.6
$1N273604: R120.2 U33.4
$1N273608: LED17.2 R120.1
$1N273613: R117.2 U32.4
$1N273617: R121.1 U34.4
$1N273621: LED16.2 R118.2
$1N273622: R118.1 U33.6
$1N273629: R122.1 U34.6
$1N273692: LED15.2 R119.1
$1N274851: LED20.2 R123.1
$1N274908: LED18.2 R121.2
$1N274912: LED19.2 R122.2
$1N294904: R125.1 U36.4
$1N294932: R130.1 U36.6
$1N435889: R113.2 U31.4
$1N436520: R123.2 U35.4
$1N436728: R126.1 U38.4
$1N436748: R131.1 U38.6
$1N436840: U22.6 U36.1 U36.3 U40.3
$1N437130: R136.1 U40.4
$1N437759: R139.1 U41.4
$1N437764: R140.1 U42.4
$1N437769: R144.1 U41.6
$1N437776: R145.1 U42.6
$1N437785: U22.11 U40.1 U41.1 U41.3
$1N437808: U22.8 U39.3 U42.1 U42.3
$1N438003: R150.1 U40.6
$1N447003: U20.5 U43.6
$1N456031: LED1.2 R95.2

Pads without a net: U35 6

## Via types
v1: diameter 0.61, hole 0.305, Top Layer to Bottom Layer, 345 vias

## Routing (per net, layer and track width the routed paths; a pad name or vN(x,y) marks a point on that pad's centre or on a via; arc(x,y) is an arc through that point)
3V3: length 655.4
  Top Layer w0.203: R75.2 29.46,94.04 29.21,94.3 ; 29.21,92.86 29.21,92.6 v1(28.58,91.97) ; 29.21,92.86 31.45,90.61 R72.2 ; 29.21,92.86 29.21,94.3 ; v1(134.94,57.8) 135.27,57.8 135.4,57.93 ; v1(91.95,7.72) U6.6 ; U14.6 v1(141.99,54.25) ; v1(28.96,101.36) 28.96,97.81 29.21,97.55 29.21,97.17 ; 29.21,94.3 29.21,97.17 ; 29.21,97.17 30.7,97.17 R74.2 ; U12.6 v1(141.8,40.53) ; 135.65,44.62 135.12,44.09 v1(135.07,44.09) ; R99.2 17.53,63.91 17.53,63.39 v1(17.97,62.95) ; U5.6 v1(78.23,7.64) ; v1(81.79,14.5) 81.79,13.8 81.97,13.62
  Top Layer w0.406: 46.01,92.6 44.58,92.6 44.09,93.09 C2.1 ; 46.01,92.6 46.01,91.12 R65.2 ; 46.01,92.6 46.99,92.6 48.51,94.12 48.51,95.49 ; R67.2 46.65,98.35 48.23,98.35 48.51,98.06 ; v1(48.51,101.24) 48.51,98.06 ; 48.51,98.06 48.51,98.06 48.51,95.49 ; v1(21.84,90.57) 21.4,90.57 21.4,90.57 ; 98.3,14.69 98.3,13.61 98.81,13.1 108.84,13.1 109.22,13.48 109.22,14.12 109.92,14.81 C15.2 ; U12.16 136.06,34.18 136.46,34.59 136.46,43.81 135.65,44.62 135.02,45.25 135.02,46.03 ; C1.2 21.4,90.57 ; 21.4,90.57 21.4,91.25 U18.14 ; 85.6,14.61 85.6,13.52 86.11,13.01 94.97,13.01 95.38,13.42 95.38,14.12 96.01,14.75 ; 134.94,58.39 135.4,57.93 136.02,57.93 136.52,57.42 136.52,48.41 136.02,47.9 U14.16 ; C28.1 64.72,97.8 v1(64.72,102.13) ; 134.93,71.63 136.52,70.04 136.52,61.02 136.02,60.51 134.93,60.51 ; C8.2 83.86,14.6 82.95,14.6 81.51,13.16 71.95,13.16 ; 48.51,95.49 46.56,95.49 R66.2 ; U43.5 59.73,14.12 59.48,14.37 ; 59.22,14.12 C22.1 59.22,17.02 U20.14 ; 71.88,13.23 U5.16 ; 134.94,58.39 C21.2
  Top Layer w0.457: U19.3 43.46,93.11 C2.1
  Top Layer w0.533: 12.21,32.37 12.34,32.5 13.22,32.5 ; 92.71,92.23 92.71,90.31 92.01,89.61 C26.1 ; 92.71,92.23 92.71,95.39 ; 92.71,92.23 92.32,91.84 U41.5 ; 106.46,93.4 106.46,90.8 C30.1 ; 106.46,93.4 106.34,93.53 U39.5 ; 106.46,93.4 106.46,96.88 ; 64.77,95.13 64.77,97.74 ; 64.77,95.13 64.76,95.14 U38.5 ; 64.77,95.13 64.77,91.75 ; C27.1 64.07,89.43 64.77,90.13 64.77,91.75 ; 51.68,14.43 C33.1 51.68,19.19 ; 64.77,91.75 64.73,91.71 U36.5 ; U26.5 12.35,73.14 v1(12.22,73.27) ; C14.1 v1(12.29,68.06) U27.5 ; 92.71,95.39 92.71,96.92 92.26,97.36 C29.1 ; 92.71,95.39 U42.5 ; 106.46,96.88 106.39,96.96 U40.5 ; 106.46,96.88 106.46,99.56 C31.1 ; 51.68,22.59 51.68,25.19 C35.1 ; 51.68,22.59 51.66,22.57 U45.5 ; 51.68,22.59 51.68,19.19 ; 112.27,90.14 U22.14 ; 12.2,42.91 12.32,42.79 13.22,42.79 ; v1(12.22,58.15) 12.45,57.93 U29.5 ; U30.5 v1(12.33,52.82) C16.2 ; U44.5 51.63,19.15 51.68,19.19 ; 13.22,62.98 12.34,62.98 v1(12.21,62.85) ; C18.2 U33.5 ; 13.01,27.42 v1(12.14,27.42) ; U31.5 12.34,47.74 12.21,47.61 ; U37.5 121.29,98.31
  Top Layer w0.61: 97.66,14.69 C13.2 96.08,14.69 96.01,14.75 95.52,14.75 v1(95.5,14.77) ; 97.66,14.69 97.67,14.69 U8.16 ; 97.66,14.69 98.3,14.69 ; 134.93,71.63 134.93,74.22 134.93,74.23 ; C17.2 134.94,24.08 123.19,12.34 112.78,12.34 112.01,13.1 U10.16 ; C19.2 134.94,47.89 ; C29.1 91.57,98.63 91.57,103.4 90.17,104.79 102.94,104.79 106.4,101.34 ; C32.1 121.28,100.86 120.78,101.36 106.43,101.36 106.4,101.34 ; 134.97,33.46 U12.16 ; 134.97,33.46 134.97,34.18 ; 134.97,33.46 134.97,33.42 ; 106.4,101.34 C31.1 ; 85.6,14.7 85.59,14.69 C8.2 ; 134.93,60.51 134.93,59.2 C21.2 ; C3.2 71.88,14.56 U5.16 ; 112.01,14.78 111.98,14.81 C15.2 ; 134.97,33.42 v1(135.54,33.42) ; 134.97,33.42 134.97,32.4 ; C30.1 106.53,89.68 106.96,89.25 111.38,89.25 112.27,90.14 ; v1(15.49,75.33) 15.49,78.57 ; 134.52,47.9 U14.16 ; U16.16 134.52,60.6
  Top Layer w0.914: 58.63,14.12 37.42,14.12 27.97,23.57 27.97,76.32 25.72,78.57 10.34,78.57 8.38,80.52 8.38,81.93 8.64,82.19 ; 58.63,14.12 59.22,14.12 ; 58.63,14.12 62.79,9.96 69.25,9.96 72.14,12.84 ; 6.72,83.58 7.37,84.23 7.37,85.11 15.37,85.11 16.38,86.12 16.38,101.24 19.94,104.79 v1(28.96,104.79) v1(48.51,104.79) 49.46,105.75 v1(64.72,105.75) 89.34,105.75 90.04,105.05
  Bottom Layer w0.203: v1(17.97,62.95) 16.89,64.03 13.39,64.03 12.41,63.05 ; v1(81.79,14.5) 78.23,10.94 v1(78.23,7.64) ; v1(95.5,14.77) 91.95,11.22 v1(91.95,7.72) ; v1(135.07,44.09) 138.63,40.53 v1(141.8,40.53) ; v1(141.99,54.25) 138.49,54.25 v1(134.94,57.8)
  Bottom Layer w0.406: v1(48.51,104.79) v1(48.51,101.24) ; v1(28.96,101.36) v1(28.96,104.79) ; v1(28.58,91.97) 24,91.97 22.61,90.57 v1(21.84,90.57) ; v1(64.72,105.75) v1(64.72,102.13)
  Bottom Layer w0.61: v1(12.14,27.42) 12.22,27.5 v1(12.22,32.37) 12.21,32.38 v1(12.21,37.62) v1(12.21,42.91) 12.22,42.93 v1(12.22,47.61) v1(12.22,58.15) 12.21,58.17 v1(12.21,62.85) ; 12.41,63.05 12.29,63.17 v1(12.29,68.06) 12.29,73.2 v1(12.22,73.27) 13.43,73.27 v1(15.49,75.33)
3V3_GATED: length 200.6
  Top Layer w0.203: R95.1 13.75,77.2 v1(14.48,77.2) ; Q42.5 v1(11.18,79.77)
  Top Layer w1.219: F2.1 61.84,98.33 61.84,102.89 ; 61.84,102.89 20.7,102.89 18.29,100.47 ; 61.84,102.89 62.73,103.78 88.39,103.78 89.79,102.38 F3.1 ; 18.16,100.35 18.16,81.81 19.3,80.66 ; 19.3,80.66 19.49,80.47 27.5,80.47 30.1,77.87 30.1,29.81 31.32,28.59 F1.1 ; 19.3,80.66 19.3,80.47 12.45,80.47 ; Q42.6 Q42.8
  Bottom Layer w0.203: v1(11.18,79.77) 11.9,79.77 v1(14.48,77.2)
3V3_IHB0: length 32.7
  Top Layer w0.533: C9.2 57.28,98.3 57.28,95.02 ; Q38.2 72.01,90.82 71.57,90.38 68.46,90.38 67.44,89.35 67.44,88.18 66.78,87.52 58.53,87.52 C37.2 57.28,88.81 57.28,95.02 ; 57.28,95.02 57.66,95.39 58.48,95.39 Q36.2 ; Q37.2 57.29,91.59
  Top Layer w0.61: 59.31,98.32 57.47,98.32 57.21,98.06 ; 59.31,98.32 59.18,98.19 ; 59.31,98.32 F2.2
3V3_IHB1: length 33
  Top Layer w0.533: 85.22,95.14 85.22,92.1 85.6,91.72 Q40.2 ; 85.22,95.14 85.61,95.53 Q39.2 ; 85.22,95.14 85.22,98.55 C11.2 ; C12.2 99.68,90.68 99.82,90.82 Q41.2
  Top Layer w0.61: 85.22,92.1 85.22,92.09 85.22,89.05 86.66,87.6 94.95,87.6 95.38,88.03 95.38,89.68 96.38,90.68 C12.2 ; C11.2 F3.2
3V3_XY: length 195.6
  Top Layer w0.533: 43.76,18.8 43.76,16.32 43.8,16.28 C4.2 ; 43.76,18.8 43.76,22.52 ; 43.76,18.8 43.87,18.9 45.07,18.9 ; 125.48,37.16 125.56,37.08 Q18.2 ; Q9.2 97.92,23.89 98.17,24.15 ; Q6.2 88.01,24.06 88.09,24.15 ; 117.85,24.15 117.73,24.03 Q15.2 ; Q22.2 125.56,50.29 125.48,50.37 ; Q8.2 94.61,23.89 94.36,24.15 ; 107.82,24.15 Q12.2 ; Q32.2 125.73,83.33 125.48,83.08 ; 101.3,24.15 101.22,24.06 Q10.2 ; Q13.2 111.13,24.15 ; 125.48,63.6 125.56,63.52 Q26.2 ; Q11.2 104.52,24.03 104.64,24.15 ; 120.78,24.15 121.03,23.89 Q16.2 ; Q2.2 74.8,24.06 74.89,24.15 ; C5.2 43.76,25.33 43.76,22.52 ; 43.76,22.52 43.82,22.58 Q33.2 ; 91.43,24.15 91.31,24.03 Q7.2 ; Q31.2 125.6,80.03 125.48,80.15 ; Q24.2 125.73,56.89 125.48,56.64 ; 125.48,43.69 Q20.2 ; Q30.2 125.56,76.73 125.48,76.81 ; Q25.2 125.73,60.22 125.48,60.47 ; 125.48,70.12 Q28.2 ; C6.2 68.72,24.15 71.76,24.15 71.5,23.89 Q1.2 ; Q17.2 125.73,33.78 125.48,34.03 ; 125.48,66.94 125.6,66.82 Q27.2 ; Q3.2 78.11,24.03 78.22,24.15 ; 125.48,53.71 125.6,53.59 Q23.2 ; Q14.2 114.43,24.06 114.51,24.15 ; 125.48,40.5 125.6,40.38 Q19.2 ; Q21.2 125.48,46.99 ; 81.41,24.15 Q4.2 ; Q29.2 125.48,73.42 ; Q5.2 84.71,24.15
  Top Layer w0.61: C6.2 67.67,24.16 66.93,24.91 66.93,25.93 66.04,26.81 45.07,26.81 C5.2 ; 71.76,24.15 123.57,24.15 125.48,26.06 125.48,60.89 125.48,60.89 125.48,83.08
  Top Layer w0.914: F1.2 53.98,28.59 53.98,26.82
GND: length 155.3
  Top Layer w0.203: 6.6,36.31 v1(6.6,37.57) 6.6,38.85 ; 15.67,37.58 v1(17.42,37.58) ; v1(17.42,37.58) 17.42,38.12 ; v1(17.42,37.58) 17.44,37.56 R107.2 ; v1(17.43,52.82) 17.43,53.77 R88.1 ; v1(17.43,52.82) 17.44,52.81 R91.1 ; v1(17.43,52.82) 15.69,52.82 ; R105.2 17.44,27.59 v1(17.3,27.45) ; R111.2 17.43,33.44 v1(17.43,32.5) ; LED1.1 v1(8.64,78.12) ; 6.6,54.09 v1(6.6,52.81) 6.6,51.55 ; R92.2 17.45,42.77 v1(17.43,42.79) ; LED19.1 v1(6.6,32.5) LED18.1 ; 6.6,56.63 v1(6.6,57.89) 6.57,57.92 LED8.1 ; v1(17.39,73.17) 17.41,73.15 ; 17.41,73.15 R115.1 ; 17.41,73.15 17.42,73.14 ; 17.44,67.92 17.44,67.92 17.44,68.05 ; 17.44,67.92 17.44,68.1 ; 17.44,67.92 17.44,67.91 17.41,67.87 R106.2 ; R85.1 17.44,57.89 v1(17.43,57.9) 17.4,57.93 U29.2 ; v1(17.43,42.79) 17.43,43.72 R89.1 ; v1(17.43,42.79) 15.69,42.79 ; 141.22,78.12 v1(141.86,78.12) ; 141.22,78.12 141.22,78.13 140.4,78.13 ; 141.22,78.12 U17.4 ; 15.67,68.06 15.69,68.04 v1(17.43,68.04) 17.44,68.05 ; 17.44,68.1 17.44,68.1 17.44,68.05 ; 17.44,68.1 R97.2 ; LED2.1 v1(6.6,73.13) LED3.1 ; LED12.1 v1(6.6,47.73) LED13.1 ; R93.1 17.43,48.75 v1(17.43,47.74) ; 15.69,32.5 v1(17.43,32.5) ; v1(17.43,32.5) 17.44,32.49 R96.1 ; LED6.1 v1(6.6,62.97) LED7.1 ; 15.67,73.14 17.42,73.14 17.41,73.13 R116.2 ; R86.2 17.44,47.73 v1(17.43,47.74) ; 6.6,28.69 v1(6.6,27.41) ; U8.4 v1(102.11,7.76) ; U35.1 15.61,26.54 16.49,26.54 17.3,27.35 v1(17.3,27.45) ; LED4.1 v1(6.6,68.05) LED5.1 ; v1(17.3,27.45) 15.42,27.45 15.39,27.48 ; U16.4 v1(141.86,64.41) ; 15.69,47.74 v1(17.43,47.74) ; LED15.1 v1(6.6,42.66) LED14.1 ; 15.67,62.98 16.53,62.98 v1(16.79,62.72) ; 115.82,9.23 v1(115.82,7.77)
  Top Layer w0.457: 107.77,96.96 v1(108.72,96.96) ; C35.2 v1(54.13,25.24) ; v1(44.68,91.69) 44.68,91.69 C2.2 ; 46.56,93.92 46.88,93.92 v1(47.52,94.55) ; v1(94.65,98) 94.59,97.94 C29.2 ; 107.95,99.62 108.46,100.13 v1(108.78,100.13) ; U14.8 141.79,56.79 v1(141.79,56.79) ; v1(140.4,43.84) 140.4,43.83 U12.8 ; U5.8 80.78,9.1 v1(81.54,9.1) ; 66.27,97.74 v1(67.23,97.74) ; U8.8 107.19,7.83 v1(107.19,7.83) ; Q39.5 v1(83.15,95.53) ; U41.2 v1(94.95,91.84) ; 94.49,8.97 v1(94.49,7.83) ; 120.91,8.97 v1(120.91,7.96) ; Q33.5 v1(41.75,22.58) ; 46.56,96.96 v1(47.52,96.96) ; U42.2 v1(94.95,95.39) ; U38.2 v1(66.88,95.14) ; Q36.5 v1(55.21,95.4) ; 52.83,19.15 v1(53.78,19.15) ; 140.65,69.49 v1(141.79,69.49) ; 83.99,91.72 v1(83.12,91.72) ; C27.2 v1(66.35,88.92) ; U45.2 v1(53.77,22.57) ; Q34.5 v1(41.74,18.9) ; 65.93,91.71 v1(66.89,91.71) ; 140.65,83.21 v1(141.79,83.21) ; Q37.5 v1(55.25,91.59) ; 53.08,16.28 v1(54.04,16.28)
  Top Layer w0.533: v1(29.82,98.66) 29.87,98.61 30.63,98.61 ; 107.61,93.53 v1(108.62,93.53) ; 30.74,95.57 29.83,95.57 v1(29.81,95.55) ; 99.82,89.39 v1(99.82,88.44) ; Q6.5 v1(88.01,26.15) ; Q13.5 v1(111.13,26.15) ; 101.22,25.32 101.22,25.32 101.22,25.32 v1(101.22,26.18) ; Q31.5 v1(123.48,80.03) ; Q17.5 v1(123.45,33.78) ; 124.31,37.08 124.3,37.08 124.3,37.08 v1(123.45,37.08) ; v1(28.2,98.88) 27.66,98.88 27.65,98.87 ; Q29.5 v1(123.48,73.42) ; Q14.5 v1(114.43,26.15) ; Q22.5 v1(123.48,50.29) ; 64.92,24.91 64.95,24.94 65.76,24.94 v1(65.79,24.97) ; Q38.5 v1(72.01,88.28) ; Q32.5 v1(123.48,83.33) ; Q3.5 v1(78.11,26.18) ; 74.8,25.32 74.8,25.32 74.8,25.32 v1(74.8,26.18) ; Q28.5 v1(123.44,70.12) ; Q20.5 v1(123.45,43.69) ; Q19.5 v1(123.45,40.38) ; Q11.5 v1(104.52,26.18) ; Q4.5 v1(81.41,26.18) ; Q16.5 v1(121.03,26.15) ; U22.7 v1(119.36,99) ; v1(34.46,93.09) 34.48,93.11 U19.12 ; Q9.5 v1(97.92,26.18) ; 10.13,52.82 v1(9.18,52.82) ; Q30.5 v1(123.48,76.73) ; v1(123.44,63.52) 124.3,63.52 124.3,63.52 124.3,63.52 ; Q15.5 v1(117.73,26.15) ; 113.56,89.68 v1(114.57,89.68) ; Q25.5 v1(123.44,60.22) ; 10.13,68.06 v1(9.18,68.06) ; 10.13,37.58 v1(9.18,37.58) ; Q24.5 v1(123.48,56.89) ; Q23.5 v1(123.48,53.59) ; Q21.5 v1(123.48,46.99) ; U37.2 v1(121.29,93.24) ; Q12.5 v1(107.82,26.18) ; Q8.5 v1(94.61,26.15) ; C32.2 v1(122.68,99.59) ; Q5.5 v1(84.71,26.15) ; U43.2 v1(66.04,14.12) ; Q27.5 v1(123.44,66.82) ; Q7.5 v1(91.31,26.15) ; Q1.5 v1(71.5,26.18)
  Top Layer w0.61: C19.1 136.37,46.21 v1(137.29,46.21) ; v1(137.27,72.66) 137.27,72.66 C23.1 ; v1(23.92,89.47) 23.87,89.43 C1.1 ; v1(137.27,32.41) 136.33,32.41 136.2,32.28 ; v1(137.15,59.58) 136.77,59.2 C21.1 ; C13.1 97.28,12.65 v1(97.28,12.63) ; C26.2 94.3,89.05 v1(94.3,89.04) ; 108.03,90.73 108.79,91.5 v1(108.79,91.56) ; C3.1 70.23,12.97 v1(69.73,12.47) ; C8.1 84.59,12.65 v1(84.59,12.51) ; C22.2 60.64,15.68 v1(61.5,15.68) ; C15.1 v1(110.36,12.51)
  Top Layer w1.219: C36.1 1.65,87.01 H4.1
  vias: v1(6.98,87.39) v1(6.98,86.68) v1(40.39,25.8) v1(40.39,25.04) v1(40.59,16.46) v1(40.59,15.7) v1(53.98,98.7) v1(53.98,97.94) v1(54,89.18) v1(54,88.41) v1(68.33,27.37) v1(68.83,87.47) v1(69.09,27.37) v1(69.6,87.47) v1(81.93,98.95) v1(81.93,98.19) v1(81.98,89.24) v1(81.98,88.48) v1(96.65,87.47) v1(97.41,87.47) v1(122.25,31.39) v1(122.25,30.62)
$1I231724\$1N959: length 1.4
  Top Layer w0.533: Q1.1 70.55,21.72 R1.2
$1I231724\$1N972: length 1.4
  Top Layer w0.533: R3.2 73.85,21.72 73.85,22.95
$1I231724\$1N982: length 1.4
  Top Layer w0.533: R4.2 75.75,21.72 Q2.3
$1I231724\$1N1257: length 1.4
  Top Layer w0.533: Q4.1 80.46,21.72 R7.2
$1I231724\$1N1261: length 1.4
  Top Layer w0.533: Q3.3 79.05,21.72 R6.2
$1I231724\$1N1273: length 1.4
  Top Layer w0.533: Q3.1 77.16,21.72 R5.2
$1I231724\$1N2409: length 1.4
  Top Layer w0.533: 72.45,22.95 72.45,21.72 R2.2
$1I231724\$1N2651: length 1.4
  Top Layer w0.533: Q4.3 82.36,21.72 R8.2
$1I231724\$1N7281: length 1.4
  Top Layer w0.533: 87.06,22.95 87.06,21.72 R11.2
$1I231724\$1N7282: length 1.4
  Top Layer w0.533: R12.2 88.96,21.72 Q6.3
$1I231724\$1N7283: length 1.4
  Top Layer w0.533: R13.2 90.36,21.72 Q7.1
$1I231724\$1N7284: length 1.4
  Top Layer w0.533: Q7.3 92.26,21.72 R14.2
$1I231724\$1N7285: length 1.4
  Top Layer w0.533: R15.2 93.67,21.72 Q8.1
$1I231724\$1N7286: length 1.4
  Top Layer w0.533: Q8.3 95.57,21.72 R16.2
$1I231724\$1N7287: length 1.4
  Top Layer w0.533: Q5.1 83.76,21.72 R9.2
$1I231724\$1N7288: length 1.4
  Top Layer w0.533: R10.2 85.66,21.72 85.66,22.95
$1I237831\$1N959: length 1.4
  Top Layer w0.533: R17.2 96.97,21.72 Q9.1
$1I237831\$1N972: length 1.4
  Top Layer w0.533: 100.27,22.95 100.27,21.72 R19.2
$1I237831\$1N982: length 1.4
  Top Layer w0.533: Q10.3 102.17,21.72 R20.2
$1I237831\$1N1257: length 1.4
  Top Layer w0.533: Q12.1 106.87,21.72 R23.2
$1I237831\$1N1261: length 1.4
  Top Layer w0.533: R22.2 105.47,21.72 Q11.3
$1I237831\$1N1273: length 1.4
  Top Layer w0.533: R21.2 103.57,21.72 Q11.1
$1I237831\$1N2409: length 1.4
  Top Layer w0.533: Q9.3 98.87,21.72 R18.2
$1I237831\$1N2651: length 1.4
  Top Layer w0.533: R24.2 108.77,21.72 Q12.3
$1I237831\$1N7281: length 1.4
  Top Layer w0.533: R27.2 113.48,21.72 113.48,22.95
$1I237831\$1N7282: length 1.4
  Top Layer w0.533: Q14.3 115.38,21.72 R28.2
$1I237831\$1N7283: length 1.4
  Top Layer w0.533: R29.2 116.78,21.72 Q15.1
$1I237831\$1N7284: length 1.4
  Top Layer w0.533: R30.2 118.68,21.72 118.68,22.95
$1I237831\$1N7285: length 1.4
  Top Layer w0.533: Q16.1 120.08,21.72 R31.2
$1I237831\$1N7286: length 1.4
  Top Layer w0.533: Q16.3 121.98,21.72 R32.2
$1I237831\$1N7287: length 1.4
  Top Layer w0.533: Q13.1 110.17,21.72 R25.2
$1I237831\$1N7288: length 1.4
  Top Layer w0.533: R26.2 112.08,21.72 Q13.3
$1I237941\$1N959: length 1.4
  Top Layer w0.533: 128.03,32.95 127.9,32.83 Q17.1
$1I237941\$1N972: length 1.4
  Top Layer w0.533: 128.03,36.26 127.9,36.13 Q18.1
$1I237941\$1N982: length 1.4
  Top Layer w0.533: Q18.3 127.9,38.03 128.03,37.91
$1I237941\$1N1257: length 1.4
  Top Layer w0.533: 128.03,42.86 127.9,42.73 Q20.1
$1I237941\$1N1261: length 1.4
  Top Layer w0.533: Q19.3 127.9,41.33 128.03,41.21
$1I237941\$1N1273: length 1.4
  Top Layer w0.533: 128.03,39.56 127.9,39.43 Q19.1
$1I237941\$1N2409: length 1.4
  Top Layer w0.533: Q17.3 127.9,34.73 128.03,34.6
$1I237941\$1N2651: length 1.4
  Top Layer w0.533: Q20.3 127.9,44.63 128.03,44.51
$1I237941\$1N7281: length 1.4
  Top Layer w0.533: 128.03,49.46 127.9,49.34 Q22.1
$1I237941\$1N7282: length 1.4
  Top Layer w0.533: 128.03,51.11 127.9,51.24 Q22.3
$1I237941\$1N7283: length 1.4
  Top Layer w0.533: 128.03,52.77 127.9,52.64 Q23.1
$1I237941\$1N7284: length 1.4
  Top Layer w0.533: Q23.3 127.9,54.54 128.03,54.42
$1I237941\$1N7285: length 1.4
  Top Layer w0.533: 128.03,56.07 127.9,55.94 Q24.1
$1I237941\$1N7286: length 1.4
  Top Layer w0.533: Q24.3 127.9,57.84 128.03,57.72
$1I237941\$1N7287: length 1.4
  Top Layer w0.533: 128.03,46.16 127.9,46.04 Q21.1
$1I237941\$1N7288: length 1.4
  Top Layer w0.533: Q21.3 127.9,47.94 128.03,47.81
$1I238051\$1N959: length 1.4
  Top Layer w0.533: R49.2 127.9,59.27 Q25.1
$1I238051\$1N972: length 1.4
  Top Layer w0.533: R51.2 127.9,62.57 Q26.1
$1I238051\$1N982: length 1.4
  Top Layer w0.533: Q26.3 127.9,64.47 R52.2
$1I238051\$1N1257: length 1.4
  Top Layer w0.533: R55.2 127.9,69.17 Q28.1
$1I238051\$1N1261: length 1.4
  Top Layer w0.533: Q27.3 127.9,67.77 R54.2
$1I238051\$1N1273: length 1.4
  Top Layer w0.533: Q27.1 127.9,65.87 R53.2
$1I238051\$1N2409: length 1.4
  Top Layer w0.533: R50.2 127.9,61.17 Q25.3
$1I238051\$1N2651: length 1.4
  Top Layer w0.533: R56.2 127.9,71.07 Q28.3
$1I238051\$1N7281: length 1.4
  Top Layer w0.533: Q30.1 127.9,75.78 R59.2
$1I238051\$1N7282: length 1.4
  Top Layer w0.533: Q30.3 127.9,77.68 R60.2
$1I238051\$1N7283: length 1.4
  Top Layer w0.533: R61.2 127.9,79.08 Q31.1
$1I238051\$1N7284: length 1.4
  Top Layer w0.533: R62.2 127.9,80.98 Q31.3
$1I238051\$1N7285: length 1.4
  Top Layer w0.533: Q32.1 127.9,82.38 R63.2
$1I238051\$1N7286: length 1.4
  Top Layer w0.533: Q32.3 127.9,84.28 R64.2
$1I238051\$1N7287: length 1.4
  Top Layer w0.533: Q29.1 127.9,72.47 R57.2
$1I238051\$1N7288: length 1.4
  Top Layer w0.533: R58.2 127.9,74.37 Q29.3
DRV_X0_N: length 20.8
  Top Layer w0.203: 86.87,14.7 v1(86.87,16.15) ; R1.1 v1(70.68,19.07)
  Bottom Layer w0.203: v1(86.87,16.15) 72.01,16.15 70.68,17.48 v1(70.68,19.07)
DRV_X0_P: length 5.9
  Top Layer w0.203: R2.1 72.33,17.48 73.15,16.66 U5.15
DRV_X1_N: length 18.2
  Top Layer w0.203: 73.98,20.07 v1(73.98,19.05) ; 88.14,14.7 v1(88.14,16.15)
  Bottom Layer w0.203: v1(73.98,19.05) 73.98,18.37 75.57,16.78 87.51,16.78 v1(88.14,16.15)
DRV_X1_P: length 6
  Top Layer w0.203: R4.1 75.63,17.86 74.42,16.66 U5.14
DRV_X2_N: length 16.2
  Top Layer w0.203: 89.41,14.7 v1(89.41,16.15) ; 77.28,20.07 v1(77.28,19.05)
  Bottom Layer w0.203: v1(77.28,19.05) 77.28,18.37 78.36,17.29 88.27,17.29 v1(89.41,16.15)
DRV_X2_P: length 6.9
  Top Layer w0.203: U5.13 75.69,16.27 78.93,19.51 R6.1
DRV_X3_N: length 14.3
  Top Layer w0.203: 80.58,20.07 v1(80.58,19.05) ; 90.68,14.7 v1(90.68,16.15)
  Bottom Layer w0.203: v1(80.58,19.05) 80.58,18.24 81.03,17.8 89.03,17.8 v1(90.68,16.15)
DRV_X3_P: length 9.1
  Top Layer w0.203: U5.12 76.96,16.02 79.13,18.18 81.53,18.18 82.23,18.88 R8.1
DRV_X4_N: length 11.9
  Top Layer w0.203: 83.88,20.07 v1(83.88,19.05) ; 91.95,14.7 v1(91.95,16.15)
  Bottom Layer w0.203: v1(91.95,16.15) 89.79,18.31 84.33,18.31 83.88,18.75 v1(83.88,19.05)
DRV_X4_P: length 10.9
  Top Layer w0.203: U5.11 78.23,16.02 79.76,17.54 83.69,17.54 85.53,19.39 R10.1
DRV_X5_N: length 9.7
  Top Layer w0.203: 87.19,20.07 v1(87.19,19.05) ; 93.22,14.7 v1(93.22,16.15)
  Bottom Layer w0.203: v1(87.19,19.05) 87.29,18.94 90.3,18.94 93.09,16.15 v1(93.22,16.15)
DRV_X5_P: length 13.2
  Top Layer w0.203: R12.1 88.77,20.03 88.77,18.81 88.01,18.05 85.22,18.05 84.2,17.04 80.52,17.04 79.5,16.02 U5.10
DRV_X6_N: length 7.2
  Top Layer w0.203: v1(91.25,19.05) 90.49,19.81 90.49,20.07 ; 94.49,14.7 v1(94.49,16.15)
  Bottom Layer w0.203: v1(94.49,16.15) 91.59,19.05 v1(91.25,19.05)
DRV_X6_P: length 15.1
  Top Layer w0.203: U5.9 80.77,15.77 81.53,16.53 84.71,16.53 85.73,17.54 90.8,17.54 92.2,18.94 92.2,20.03 R14.1
DRV_X7_N: length 16.3
  Top Layer w0.203: U6.7 93.22,9.22 v1(93.22,7.7) ; 93.79,20.07 v1(93.79,19.05)
  Bottom Layer w0.203: v1(93.22,7.7) 93.22,11.07 96.39,14.24 96.39,15.89 93.79,18.5 v1(93.79,19.05)
DRV_X7_P: length 26
  Top Layer w0.203: v1(82.55,15.39) 83.06,15.89 84.96,15.89 86.11,17.04 93.67,17.04 95.44,18.8 R16.1 ; U5.7 79.5,7.65 v1(79.51,7.64)
  Bottom Layer w0.203: v1(79.51,7.64) 79.51,10.94 82.55,13.99 v1(82.55,15.39)
DRV_X8_N: length 19.9
  Top Layer w0.203: R17.1 v1(97.09,19.07) ; 113.29,14.7 v1(113.29,16.15)
  Bottom Layer w0.203: v1(113.29,16.15) 100.01,16.15 v1(97.09,19.07)
DRV_X8_P: length 5.7
  Top Layer w0.203: 98.68,20.03 98.74,19.97 98.74,18.24 99.57,17.42 U8.15
DRV_X9_N: length 18.2
  Top Layer w0.203: 100.39,20.07 v1(100.39,19.05) ; 114.56,14.7 v1(114.56,16.15)
  Bottom Layer w0.203: v1(100.39,19.05) 100.39,18.37 101.98,16.78 113.92,16.78 v1(114.56,16.15)
DRV_X9_P: length 5.9
  Top Layer w0.203: R20.1 102.04,17.86 100.84,16.66 ; U8.14 100.84,16.66
DRV_X10_N: length 16.2
  Top Layer w0.203: 103.7,20.07 v1(103.7,19.05) ; 115.83,14.7 v1(115.83,16.15)
  Bottom Layer w0.203: v1(103.7,19.05) 103.7,18.37 104.77,17.29 114.69,17.29 v1(115.83,16.15)
DRV_X10_P: length 6.7
  Top Layer w0.203: U8.13 102.11,16.27 ; R22.1 105.35,19.51 102.11,16.28
DRV_X11_N: length 14.3
  Top Layer w0.203: 117.1,14.7 v1(117.1,16.15) ; 107,20.07 v1(107,19.05)
  Bottom Layer w0.203: v1(107,19.05) 107,18.24 107.44,17.8 115.45,17.8 v1(117.1,16.15)
DRV_X11_P: length 9
  Top Layer w0.203: U8.12 103.38,16.02 ; 103.38,16.02 105.54,18.18 107.95,18.18 108.65,18.88 R24.1
DRV_X12_N: length 11.9
  Top Layer w0.203: 110.3,20.07 v1(110.3,19.05) ; 118.37,14.7 v1(118.37,16.15)
  Bottom Layer w0.203: v1(118.37,16.15) 116.21,18.31 110.74,18.31 110.3,18.75 v1(110.3,19.05)
DRV_X12_P: length 10.7
  Top Layer w0.203: U8.11 104.65,16.02 ; 104.65,16.02 106.17,17.54 110.11,17.54 111.95,19.39 R26.1
DRV_X13_N: length 9.7
  Top Layer w0.203: 113.6,20.07 v1(113.6,19.05) ; 119.64,14.7 v1(119.64,16.15)
  Bottom Layer w0.203: v1(113.6,19.05) 113.71,18.94 116.71,18.94 119.51,16.15 v1(119.64,16.15)
DRV_X13_P: length 13
  Top Layer w0.203: 105.92,16.02 106.94,17.04 110.62,17.04 111.63,18.05 114.43,18.05 115.19,18.81 115.19,20.03 ; U8.10 105.92,16.02
DRV_X14_N: length 7
  Top Layer w0.203: 120.91,14.7 v1(120.91,16.15) ; 116.9,19.81 v1(117.67,19.05)
  Bottom Layer w0.203: v1(117.67,19.05) 118.01,19.05 v1(120.91,16.15)
DRV_X14_P: length 15
  Top Layer w0.203: U8.9 109.02,16.53 ; 118.62,20.03 118.62,18.94 117.22,17.54 112.14,17.54 111.13,16.53 108.33,16.53
DRV_X15_N: length 12.2
  Top Layer w0.203: 120.21,20.07 v1(120.21,19.05) ; 119.63,9.31 119.64,9.31 v1(119.64,11.03)
  Bottom Layer w0.203: v1(119.64,11.03) 119.64,11.58 121.67,13.61 121.67,16.66 120.21,18.12 v1(120.21,19.05)
DRV_X15_P: length 28
  Top Layer w0.203: R32.1 121.86,18.8 120.09,17.04 112.52,17.04 111.38,15.89 109.47,15.89 108.33,14.75 v1(108.33,14.21) ; U8.7 105.92,7.61 ; v1(105.92,7.6) 105.92,9.3
  Bottom Layer w0.203: v1(105.92,7.6) 105.92,11.79 v1(108.33,14.21)
